# Altium project Chronos.PrjPcb (part 2 of 3)

## Sheet 04 - Camera Interface.SchDoc: Camera Interface (DPHYs)
size A3; Page Number: 4; Page Size: B; Page Count: 12; Board Rev: B; Project Name: CrossLink-NX Evaluation Board; RevCode: 1.0; Doc: 305-PD-19-0819; DsnPath: C:\Users\HAltinkilit\Downloads\Crosslink-NX-Design-Files\CrossLink-NX-Eval-Brd-Schematic-RevB-191122.DSN; SchematicName: SCHEMATIC1; PageName: 04 - Camera Interface; PageSize: B; TopSchematic: True
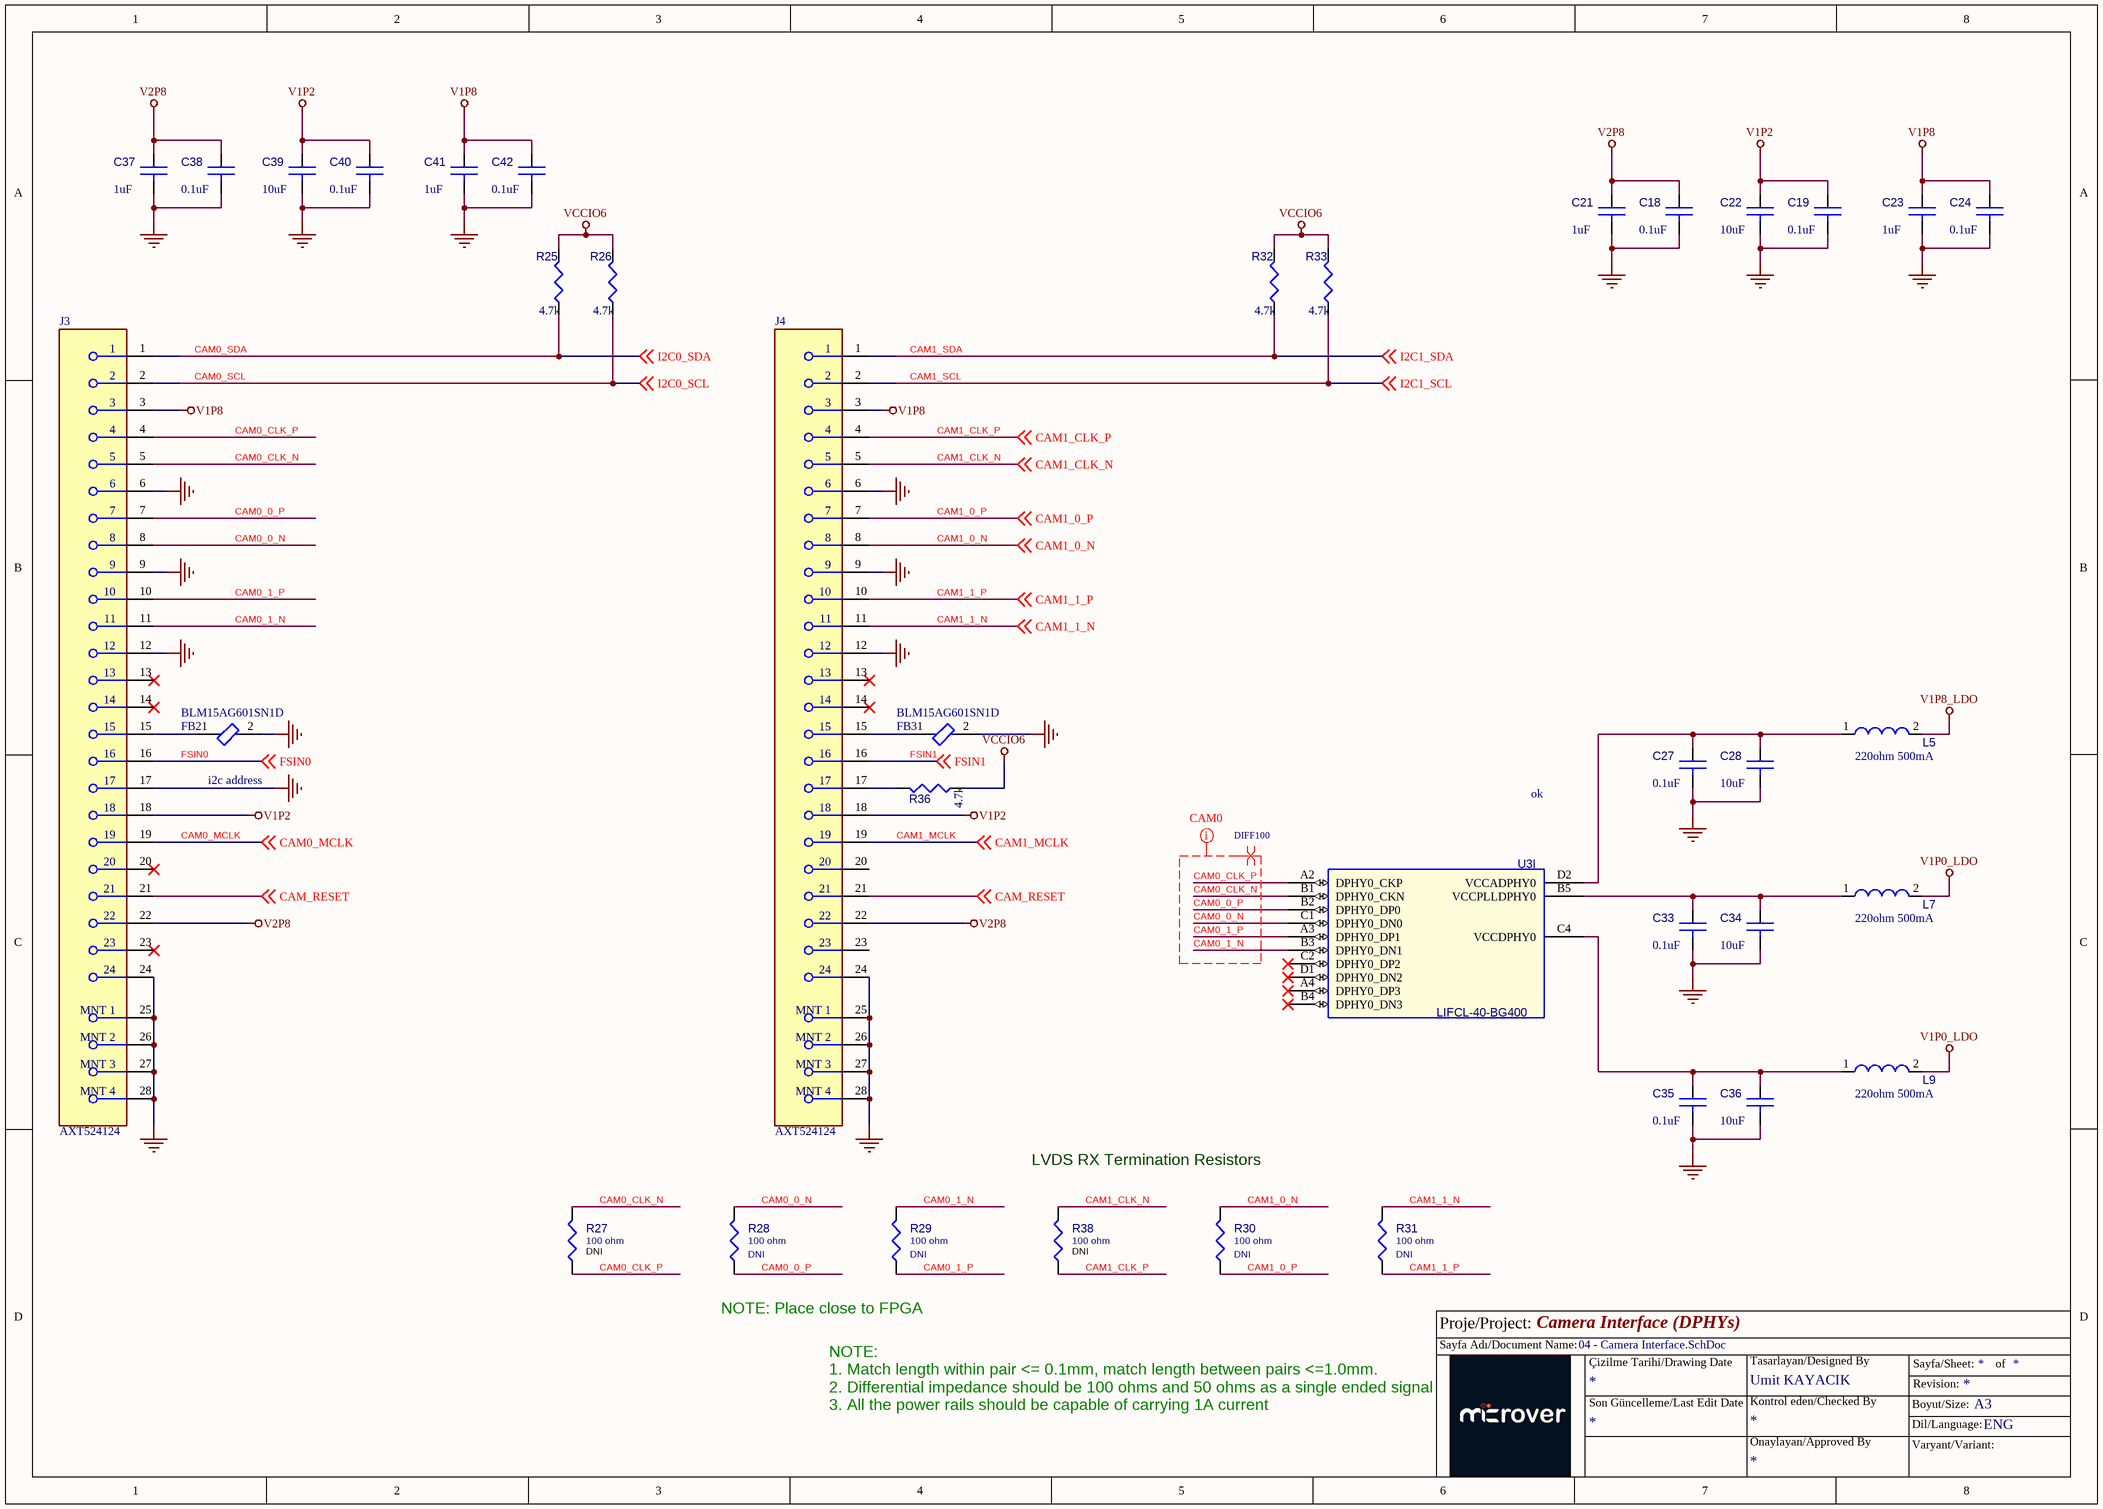
[diagram p3: 04 - Camera Interface.SchDoc]

### Parts
C18  0.1uF  [C0201]
C19  0.1uF  [C0201]
C21  1uF  [C0603]
C22  10uF  [C0603]
C23  1uF  [C0603]
C24  0.1uF  [C0201]
C27  0.1uF  [C0201]
C28  10uF  [C0402]
C33  0.1uF  [C0201]
C34  10uF  [C0402]
C35  0.1uF  [C0201]
C36  10uF  [C0402]
C37  1uF  [C0603]
C38  0.1uF  [C0201]
C39  10uF  [C0603]
C40  0.1uF  [C0201]
C41  1uF  [C0603]
C42  0.1uF  [C0201]
FB2  BLM15AG601SN1D  [FP-BLM15-0_05-MFG]
FB3  BLM15AG601SN1D  [FP-BLM15-0_05-MFG]
J3  AXT524124  [FP-AXT524124-MFG]
J4  AXT524124  [FP-AXT524124-MFG]
L5  220ohm 500mA  [FB0402]
L7  220ohm 500mA  [FB0402]
L9  220ohm 500mA  [FB0402]
R25  4.7k  [R0402]
R26  4.7k  [R0402]
R27  100 ohm  [R0201]
R28  100 ohm  Assy: DNI  [R0201]
R29  100 ohm  Assy: DNI  [R0201]
R30  100 ohm  Assy: DNI  [R0201]
R31  100 ohm  Assy: DNI  [R0201]
R32  4.7k  [R0402]
R33  4.7k  [R0402]
R36  4.7k  [R0402]
R38  100 ohm  [R0201]
U3  LIFCL-40-BG400  [LIFCL-40-BG400]  (part I of 15)

### Nets
GND: C18.2 C19.2 C21.2 C22.2 C23.2 C24.2 C27.2 C28.2 C33.2 C34.2 C35.2 C36.2 C37.2 C38.2 C39.2 C40.2 C41.2 C42.2 FB2.2 FB3.2 J3.6 J3.9 J3.12 J3.17 J3.24 J3.25(MNT_1) J3.26(MNT_2) J3.27(MNT_3) J3.28(MNT_4) J4.6 J4.9 J4.12 J4.24 J4.25(MNT_1) J4.26(MNT_2) J4.27(MNT_3) J4.28(MNT_4)
V1P0_LDO: L7.2 L9.2
V1P2: C19.1 C22.1 C39.1 C40.1 J3.18 J4.18
V1P8: C23.1 C24.1 C41.1 C42.1 J3.3 J4.3
V1P8_LDO: L5.2
V2P8: C18.1 C21.1 C37.1 C38.1 J3.22 J4.22
VCCIO6: R25.1 R26.1 R32.1 R33.1 R36.2
CAM0_0_N: J3.8 R28.2 U3.C1(DPHY0_DN0)
CAM0_0_P: J3.7 R28.1 U3.B2(DPHY0_DP0)
CAM0_1_N: J3.11 R29.2 U3.B3(DPHY0_DN1)
CAM0_1_P: J3.10 R29.1 U3.A3(DPHY0_DP1)
CAM0_CLK_N: J3.5 R27.2 U3.B1(DPHY0_CKN)
CAM0_CLK_P: J3.4 R27.1 U3.A2(DPHY0_CKP)
CAM0_MCLK: J3.19 ; off-sheet CAM0_MCLK
CAM0_SCL: J3.2 R26.2 ; off-sheet I2C0_SCL  [also labelled I2C0_SCL]
CAM0_SDA: J3.1 R25.2 ; off-sheet I2C0_SDA  [also labelled I2C0_SDA]
CAM1_0_N: J4.8 R30.2 ; off-sheet CAM1_0_N
CAM1_0_P: J4.7 R30.1 ; off-sheet CAM1_0_P
CAM1_1_N: J4.11 R31.2 ; off-sheet CAM1_1_N
CAM1_1_P: J4.10 R31.1 ; off-sheet CAM1_1_P
CAM1_CLK_N: J4.5 R38.2 ; off-sheet CAM1_CLK_N
CAM1_CLK_P: J4.4 R38.1 ; off-sheet CAM1_CLK_P
CAM1_MCLK: J4.19 ; off-sheet CAM1_MCLK
CAM1_SCL: J4.2 R33.2 ; off-sheet I2C1_SCL  [also labelled I2C1_SCL]
CAM1_SDA: J4.1 R32.2 ; off-sheet I2C1_SDA  [also labelled I2C1_SDA]
CAM_RESET: J3.21 J4.21 ; off-sheet CAM_RESET
FSIN0: J3.16 ; off-sheet FSIN0
FSIN1: J4.16 ; off-sheet FSIN1
NetC27_1: C27.1 C28.1 L5.1 U3.D2(VCCADPHY0)
NetC33_1: C33.1 C34.1 L7.1 U3.B5(VCCPLLDPHY0)
NetC35_1: C35.1 C36.1 L9.1 U3.C4(VCCDPHY0)
NetFB2_1: FB2.1 J3.15
NetFB3_1: FB3.1 J4.15
NetJ4_17: J4.17 R36.1

Not connected (* = marked no-connect by the designer): J3 13* 14* 20* 23*; J4 13* 14* 20 23; U3 A4(DPHY0_DP3)* B4(DPHY0_DN3)* C2(DPHY0_DP2)* D1(DPHY0_DN2)*

### Layout directives
net class CAM0: CAM0_0_N, CAM0_0_P, CAM0_1_N, CAM0_1_P, CAM0_CLK_N, CAM0_CLK_P
differential pair; differential pair class DIFF100: CAM0_0_N, CAM0_0_P, CAM0_1_N, CAM0_1_P, CAM0_CLK_N, CAM0_CLK_P

### Notes on the sheet
- (near FB2) i2c address
- ok
- LVDS RX Termination Resistors
- (near R27) DNI
- (near R38) DNI
- NOTE: Place close to FPGA
- NOTE:
  1. Match length within pair <= 0.1mm, match length between pairs <=1.0mm.
  2. Differential impedance should be 100 ohms and 50 ohms as a single ended signal
  3. All the power rails should be capable of carrying 1A current
- Proje/Project:
- Sayfa Adı/Document Name:
- Çizilme Tarihi/Drawing Date
- Umit KAYACIK
- Tasarlayan/Designed By
- Sayfa/Sheet:
- Revision:
- of
- Son Güncelleme/Last Edit Date
- Kontrol eden/Checked By
- Onaylayan/Approved By
- Boyut/Size:
- Varyant/Variant:
- Dil/Language:
- A3
- ENG

### Library data of the parts
C18 C38 = 0u1_0402: CAP CER 0.1UF 25V 10% X5R 0201; Manufacturer: Murata; Manufacturer Part Number: GRM033R61E104KE14J; Part Reference: C18; Class: Discrete; Digikey P/N: 399-3521-2-ND; Assy: -; Value: 0.1uF; PCB Footprint: C0201
C19 C40 = 0u1_0402: CAP CER 0.1UF 25V 10% X5R 0201; Manufacturer: Murata; Manufacturer Part Number: GRM033R61E104KE14J; Part Reference: C19; Class: Discrete; Digikey P/N: 399-3521-2-ND; Assy: -; Value: 0.1uF; PCB Footprint: C0201
C21 C37 = 10uF_0603: CAP CECAP CER 10UF 10V X5R 20% 0603; Manufacturer: Taiyo Yuden; Manufacturer Part Number: LMK107BJ106MALTD; Part Reference: C21; Class: Discrete; Digikey P/N: 587-2562-1-ND; Assy: -; Value: 1uF; PCB Footprint: C0603
C22 C39 = 10uF_0603: CAP CECAP CER 10UF 10V X5R 20% 0603; Manufacturer: Taiyo Yuden; Manufacturer Part Number: LMK107BJ106MALTD; Part Reference: C22; Class: Discrete; Digikey P/N: 587-2562-1-ND; Assy: -; Value: 10uF; PCB Footprint: C0603
C23 C41 = 10uF_0603: CAP CECAP CER 10UF 10V X5R 20% 0603; Manufacturer: Taiyo Yuden; Manufacturer Part Number: LMK107BJ106MALTD; Part Reference: C23; Class: Discrete; Digikey P/N: 587-2562-1-ND; Assy: -; Value: 1uF; PCB Footprint: C0603
C24 C42 = 0u1_0402: CAP CER 0.1UF 25V 10% X5R 0201; Manufacturer: Murata; Manufacturer Part Number: GRM033R61E104KE14J; Part Reference: C24; Class: Discrete; Digikey P/N: 399-3521-2-ND; Assy: -; Value: 0.1uF; PCB Footprint: C0201
C27 = 0u1_0402: CAP CER 0.1UF 25V 10% X5R 0201; Manufacturer: Murata; Manufacturer Part Number: GRM033R61E104KE14J; Part Reference: C27; Class: Discrete; Digikey P/N: 399-3521-2-ND; Assy: -; Value: 0.1uF; PCB Footprint: C0201
C28 = 10uF_0603: CAP CER 10UF 10V X5R 0402; Manufacturer: Samsung; Manufacturer Part Number: CL05A106MP8NUB8; Part Reference: C28; Class: Discrete; Digikey P/N: 587-2562-1-ND; Assy: -; Value: 10uF; PCB Footprint: C0402
C33 = 0u1_0402: CAP CER 0.1UF 25V 10% X5R 0201; Manufacturer: Murata; Manufacturer Part Number: GRM033R61E104KE14J; Part Reference: C33; Class: Discrete; Digikey P/N: 399-3521-2-ND; Assy: -; Value: 0.1uF; PCB Footprint: C0201
C34 = 10uF_0603: CAP CER 10UF 10V X5R 0402; Manufacturer: Samsung; Manufacturer Part Number: CL05A106MP8NUB8; Part Reference: C34; Class: Discrete; Digikey P/N: 587-2562-1-ND; Assy: -; Value: 10uF; PCB Footprint: C0402
C35 = 0u1_0402: CAP CER 0.1UF 25V 10% X5R 0201; Manufacturer: Murata; Manufacturer Part Number: GRM033R61E104KE14J; Part Reference: C35; Class: Discrete; Digikey P/N: 399-3521-2-ND; Assy: -; Value: 0.1uF; PCB Footprint: C0201
C36 = 10uF_0603: CAP CER 10UF 10V X5R 0402; Manufacturer: Samsung; Manufacturer Part Number: CL05A106MP8NUB8; Part Reference: C36; Class: Discrete; Digikey P/N: 587-2562-1-ND; Assy: -; Value: 10uF; PCB Footprint: C0402
FB2 FB3 = CMP-0686-00187-4: Chip Ferrite Bead, 0402, 600Ω @ 100MHz, 0.52Ω, 25%, 300mA; DC Resistance-Max: 600mR; Number of Lines: 1; DC Resistance (DCR): 520mR; Shielding: Unshielded; Impedance: 600R; Material: Steel; Frequency: 100MHz; Lead Free: Lead Free; Max DC Current: 300mA; Test Frequency: 100MHz; Depth: 0.55mm; Length: 1mm; Case Code (Imperial): 0402; Packaging: Tape and Reel; Height: 0.5mm; Max Operating Temperature: 125°C; Military Standard: Not; REACH SVHC: No SVHC; Case Code (Metric): 1005; Series: BLM15AG_SN; Core Material: Ferrite; Termination: SMD/SMT; DC Current: 300mA; Package Quantity: 10000; Width: 0.5mm; RoHS Compliant: Yes; Min Operating Temperature: -55°C; Current Rating: 300mA; Case/Package: 0402; Number of Pins: 2; Radiation Hardening: No; Tolerance: 25%; Number of Circuits: 1; Max Current Rating: 300mA
J3 J4 = AXT524124: AXT524124 24 Position 0.4 mm Pitch Dual Row Board to Board Socket Narrow Pitch Connector; NexarPartId: 7879795; Max Current Rating: 5A; Mated Stacking Heights: 1mm; Current Rating: 300mA; Voltage Rating: 60V; Max Voltage Rating (DC): 6.06kV; Number of Positions: 24; Contact Resistance: 90mΩ; Insulation Resistance: 1GΩ; Gender: Receptacle; Pitch: 400µm; Orientation: Straight; Max Operating Temperature: 85°C; Packaging: Cut Tape (CT); Depth: 3mm; Housing Material: Polymer; Ambient Temperature Range High: 85°C; Contact Plating: Gold; Mount: Surface Mount; Termination: Solder; Lead Free: Lead Free; Max Voltage Rating (AC): 60V; Length: 7.3mm; Contact Material: Gold, Nickel; Min Operating Temperature: -55°C; Height: 1.17mm; Number of Contacts: 24; Radiation Hardening: No; Connector Type: Socket; Number of Rows: 2; RoHS: Compliant
L5 = FB0603: FERRITE BEAD 600 OHM 0402 1LN; Manufacturer: Murata; Manufacturer Part Number: BLM15AX601SN1D; Part Reference: L5; Class: Discrete; Digikey P/N: 490-1014-1-ND; Value: 220ohm 500mA; Assy: -; PCB Footprint: FB0402
L7 = FB0603: FERRITE BEAD 600 OHM 0402 1LN; Manufacturer: Murata; Manufacturer Part Number: BLM15AX601SN1D; Part Reference: L7; Class: Discrete; Digikey P/N: 490-1014-1-ND; Value: 220ohm 500mA; Assy: -; PCB Footprint: FB0402
L9 = FB0603: FERRITE BEAD 600 OHM 0402 1LN; Manufacturer: Murata; Manufacturer Part Number: BLM15AX601SN1D; Part Reference: L9; Class: Discrete; Digikey P/N: 490-1014-1-ND; Value: 220ohm 500mA; Assy: -; PCB Footprint: FB0402
R25 R32 = 5k1_0402: RES SMD 2.2K OHM 1% 1/10W 0402; Manufacturer Part Number: ERJ-2RKF2201X; Manufacturer: Panasonic; Part Reference: R25; Class: Discrete; Digikey P/N: 311-5.10KLRTR-ND; Assy: -; Value: 4.7k; BOM NOTE: -; PCB Footprint: R0402
R26 R33 R36 = 5k1_0402: RES SMD 2.2K OHM 1% 1/10W 0402; Manufacturer Part Number: ERJ-2RKF2201X; Manufacturer: Panasonic; Part Reference: R26; Class: Discrete; Digikey P/N: 311-5.10KLRTR-ND; Assy: -; Value: 4.7k; BOM NOTE: -; PCB Footprint: R0402
R27 R38 = RES_100K_1W16_0402_5P: RES SMD 100 OHM 1% 1/20W 0201; Part Reference: R27; Unit Price (USD): 0.02; Total Area(sq-mm): 0.5; Wattage: 1/16W; DIST: FLAT; MAX_TEMP: RTMAX; MFG P/N: RC0201FR-07100RL; MFG: Yageo; TC1: 0; Assy: DNI; Length(mm): 1; Width(mm): 0.5; TC2: 0; Value: 100 ohm; Manufacturer: Yageo; Manufacturer Part Number: RC0201FR-07100RL; PCB Footprint: R0201
R28 = RES_100K_1W16_0402_5P: RES SMD 100 OHM 1% 1/20W 0201; Part Reference: R28; Unit Price (USD): 0.02; Total Area(sq-mm): 0.5; Wattage: 1/16W; DIST: FLAT; MAX_TEMP: RTMAX; MFG P/N: RC0201FR-07100RL; MFG: Yageo; TC1: 0; Length(mm): 1; Width(mm): 0.5; TC2: 0; Value: 100 ohm; Manufacturer: Yageo; Manufacturer Part Number: RC0201FR-07100RL; PCB Footprint: R0201
R29 = RES_100K_1W16_0402_5P: RES SMD 100 OHM 1% 1/20W 0201; Part Reference: R29; Unit Price (USD): 0.02; Total Area(sq-mm): 0.5; Wattage: 1/16W; DIST: FLAT; MAX_TEMP: RTMAX; MFG P/N: RC0201FR-07100RL; MFG: Yageo; TC1: 0; Length(mm): 1; Width(mm): 0.5; TC2: 0; Value: 100 ohm; Manufacturer: Yageo; Manufacturer Part Number: RC0201FR-07100RL; PCB Footprint: R0201
R30 = RES_100K_1W16_0402_5P: RES SMD 100 OHM 1% 1/20W 0201; Part Reference: R30; Unit Price (USD): 0.02; Total Area(sq-mm): 0.5; Wattage: 1/16W; DIST: FLAT; MAX_TEMP: RTMAX; MFG P/N: RC0201FR-07100RL; MFG: Yageo; TC1: 0; Length(mm): 1; Width(mm): 0.5; TC2: 0; Value: 100 ohm; Manufacturer Part Number: RC0201FR-07100RL; Manufacturer: Yageo; PCB Footprint: R0201
R31 = RES_100K_1W16_0402_5P: RES SMD 100 OHM 1% 1/20W 0201; Part Reference: R31; Unit Price (USD): 0.02; Total Area(sq-mm): 0.5; Wattage: 1/16W; DIST: FLAT; MAX_TEMP: RTMAX; MFG P/N: RC0201FR-07100RL; MFG: Yageo; TC1: 0; Length(mm): 1; Width(mm): 0.5; TC2: 0; Value: 100 ohm; Manufacturer Part Number: RC0201FR-07100RL; Manufacturer: Yageo; PCB Footprint: R0201
U3 = LIFCL-40-BG400: Part Reference: U3; SWAP_INFO: (S1+S2+S3+S4+S5+S6+S7+S8+S9+S10+S11+S12+S13+S14+S15); SPLIT_INST: TRUE; Graphic: LIFCL-40-BG400A.Normal; Power Pins Visible: False; Source Library: C:\USERS\SLIU1\DOCUMENTS\PCB_DESIGN\JEDI_EVAL_BOARD\SCHEMATIC\LIFCL40.OLB; Location Y-Coordinate: 0; Implementation Type: <none>; Primitive: DEFAULT; Name: I17266603; Value: LIFCL-40-BG400; Assy: -; Source Package: LIFCL-40-BG400; Source Part: LIFCL-40-BG400A.Normal; Color: Default; Location X-Coordinate: 0; PCB Footprint: LIFCL-40-BG400

## Sheet 05 - Camera Interface 2.SchDoc: Camera Interface (DPHYs)
size A3; Page Number: 5; Page Size: B; Page Count: 12; Board Rev: B; Project Name: CrossLink-NX Evaluation Board; RevCode: 1.0; Doc: 305-PD-19-0819; DsnPath: C:\Users\HAltinkilit\Downloads\Crosslink-NX-Design-Files\CrossLink-NX-Eval-Brd-Schematic-RevB-191122.DSN; SchematicName: SCHEMATIC1; PageName: 04 - Camera Interface; PageSize: B; TopSchematic: True
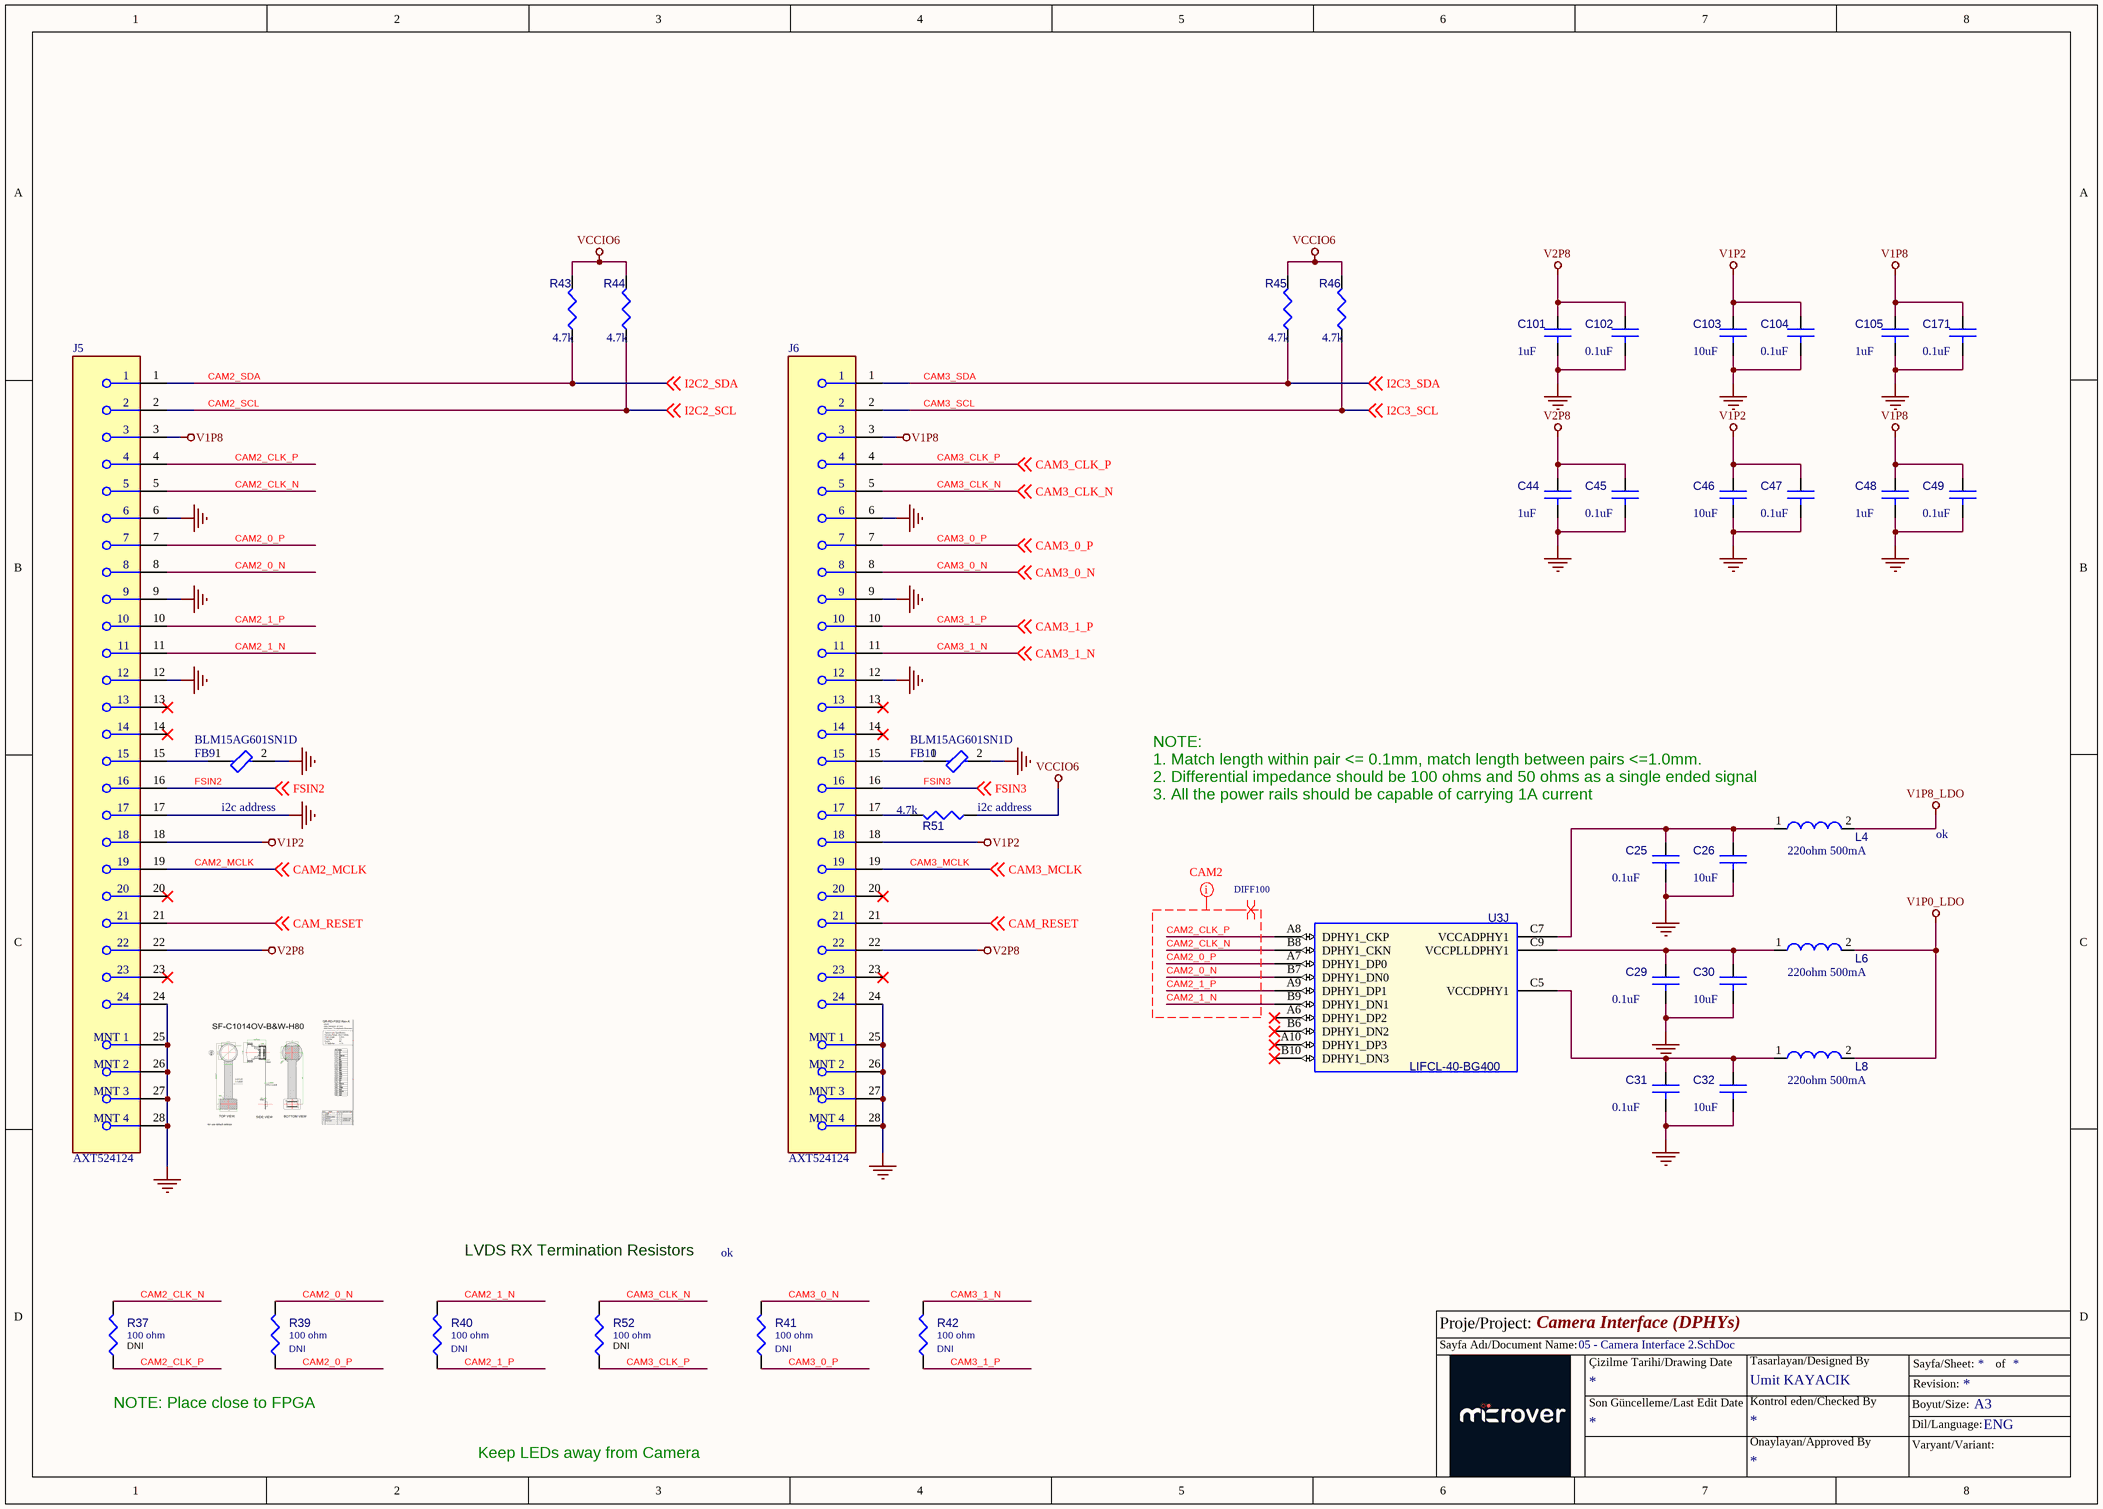
[diagram p4: 05 - Camera Interface 2.SchDoc]

### Parts
C25  0.1uF  [C0201]
C26  10uF  [C0402]
C29  0.1uF  [C0201]
C30  10uF  [C0402]
C31  0.1uF  [C0201]
C32  10uF  [C0402]
C44  1uF  [C0603]
C45  0.1uF  [C0201]
C46  10uF  [C0603]
C47  0.1uF  [C0201]
C48  1uF  [C0603]
C49  0.1uF  [C0201]
C101  1uF  [C0603]
C102  0.1uF  [C0201]
C103  10uF  [C0603]
C104  0.1uF  [C0201]
C105  1uF  [C0603]
C171  0.1uF  [C0201]
FB9  BLM15AG601SN1D  [FP-BLM15-0_05-MFG]
FB10  BLM15AG601SN1D  [FP-BLM15-0_05-MFG]
J5  AXT524124  [FP-AXT524124-MFG]
J6  AXT524124  [FP-AXT524124-MFG]
L4  220ohm 500mA  [FB0402]
L6  220ohm 500mA  [FB0402]
L8  220ohm 500mA  [FB0402]
R37  100 ohm  [R0201]
R39  100 ohm  Assy: DNI  [R0201]
R40  100 ohm  Assy: DNI  [R0201]
R41  100 ohm  Assy: DNI  [R0201]
R42  100 ohm  Assy: DNI  [R0201]
R43  4.7k  [R0402]
R44  4.7k  [R0402]
R45  4.7k  [R0402]
R46  4.7k  [R0402]
R51  4.7k  [R0402]
R52  100 ohm  [R0201]
U3  LIFCL-40-BG400  [LIFCL-40-BG400]  (part J of 15)

### Nets
GND: C25.2 C26.2 C29.2 C30.2 C31.2 C32.2 C44.2 C45.2 C46.2 C47.2 C48.2 C49.2 C101.2 C102.2 C103.2 C104.2 C105.2 C171.2 FB9.2 FB10.2 J5.6 J5.9 J5.12 J5.17 J5.24 J5.25(MNT_1) J5.26(MNT_2) J5.27(MNT_3) J5.28(MNT_4) J6.6 J6.9 J6.12 J6.24 J6.25(MNT_1) J6.26(MNT_2) J6.27(MNT_3) J6.28(MNT_4)
V1P0_LDO: L6.2 L8.2
V1P2: C46.1 C47.1 C103.1 C104.1 J5.18 J6.18
V1P8: C48.1 C49.1 C105.1 C171.1 J5.3 J6.3
V1P8_LDO: L4.2
V2P8: C44.1 C45.1 C101.1 C102.1 J5.22 J6.22
VCCIO6: R43.1 R44.1 R45.1 R46.1 R51.2
CAM2_0_N: J5.8 R39.2 U3.B7(DPHY1_DN0)
CAM2_0_P: J5.7 R39.1 U3.A7(DPHY1_DP0)
CAM2_1_N: J5.11 R40.2 U3.B9(DPHY1_DN1)
CAM2_1_P: J5.10 R40.1 U3.A9(DPHY1_DP1)
CAM2_CLK_N: J5.5 R37.2 U3.B8(DPHY1_CKN)
CAM2_CLK_P: J5.4 R37.1 U3.A8(DPHY1_CKP)
CAM2_MCLK: J5.19 ; off-sheet CAM2_MCLK
CAM2_SCL: J5.2 R44.2 ; off-sheet I2C2_SCL  [also labelled I2C2_SCL]
CAM2_SDA: J5.1 R43.2 ; off-sheet I2C2_SDA  [also labelled I2C2_SDA]
CAM3_0_N: J6.8 R41.2 ; off-sheet CAM3_0_N
CAM3_0_P: J6.7 R41.1 ; off-sheet CAM3_0_P
CAM3_1_N: J6.11 R42.2 ; off-sheet CAM3_1_N
CAM3_1_P: J6.10 R42.1 ; off-sheet CAM3_1_P
CAM3_CLK_N: J6.5 R52.2 ; off-sheet CAM3_CLK_N
CAM3_CLK_P: J6.4 R52.1 ; off-sheet CAM3_CLK_P
CAM3_MCLK: J6.19 ; off-sheet CAM3_MCLK
CAM3_SCL: J6.2 R46.2 ; off-sheet I2C3_SCL  [also labelled I2C3_SCL]
CAM3_SDA: J6.1 R45.2 ; off-sheet I2C3_SDA  [also labelled I2C3_SDA]
CAM_RESET: J5.21 J6.21 ; off-sheet CAM_RESET
FSIN2: J5.16 ; off-sheet FSIN2
FSIN3: J6.16 ; off-sheet FSIN3
NetC25_1: C25.1 C26.1 L4.1 U3.C7(VCCADPHY1)
NetC29_1: C29.1 C30.1 L6.1 U3.C9(VCCPLLDPHY1)
NetC31_1: C31.1 C32.1 L8.1 U3.C5(VCCDPHY1)
NetFB9_1: FB9.1 J5.15
NetFB10_1: FB10.1 J6.15
NetJ6_17: J6.17 R51.1

Not connected (* = marked no-connect by the designer): J5 13* 14* 20* 23*; J6 13* 14* 20* 23*; U3 A6(DPHY1_DP2)* A10(DPHY1_DP3)* B6(DPHY1_DN2)* B10(DPHY1_DN3)*

### Layout directives
net class CAM2: CAM2_0_N, CAM2_0_P, CAM2_1_N, CAM2_1_P, CAM2_CLK_N, CAM2_CLK_P
differential pair; differential pair class DIFF100: CAM2_0_N, CAM2_0_P, CAM2_1_N, CAM2_1_P, CAM2_CLK_N, CAM2_CLK_P

### Notes on the sheet
- (near FB9) i2c address
- (near R51) i2c address
- (near L4) NOTE:
  1. Match length within pair <= 0.1mm, match length between pairs <=1.0mm.
  2. Differential impedance should be 100 ohms and 50 ohms as a single ended signal
  3. All the power rails should be capable of carrying 1A current
- ok
- LVDS RX Termination Resistors
- (near R37) DNI
- (near R52) DNI
- NOTE: Place close to FPGA
- Keep LEDs away from Camera
- Proje/Project:
- Sayfa Adı/Document Name:
- Çizilme Tarihi/Drawing Date
- Umit KAYACIK
- Tasarlayan/Designed By
- Sayfa/Sheet:
- Revision:
- of
- Son Güncelleme/Last Edit Date
- Kontrol eden/Checked By
- Onaylayan/Approved By
- Boyut/Size:
- Varyant/Variant:
- Dil/Language:
- A3
- ENG

### Library data of the parts
C25 = 0u1_0402: CAP CER 0.1UF 25V 10% X5R 0201; Manufacturer: Murata; Manufacturer Part Number: GRM033R61E104KE14J; Part Reference: C25; Class: Discrete; Digikey P/N: 399-3521-2-ND; Assy: -; Value: 0.1uF; PCB Footprint: C0201
C26 = 10uF_0603: CAP CER 10UF 10V X5R 0402; Manufacturer: Samsung; Manufacturer Part Number: CL05A106MP8NUB8; Part Reference: C26; Class: Discrete; Digikey P/N: 587-2562-1-ND; Assy: -; Value: 10uF; PCB Footprint: C0402
C29 = 0u1_0402: CAP CER 0.1UF 25V 10% X5R 0201; Manufacturer: Murata; Manufacturer Part Number: GRM033R61E104KE14J; Part Reference: C29; Class: Discrete; Digikey P/N: 399-3521-2-ND; Assy: -; Value: 0.1uF; PCB Footprint: C0201
C30 = 10uF_0603: CAP CER 10UF 10V X5R 0402; Manufacturer: Samsung; Manufacturer Part Number: CL05A106MP8NUB8; Part Reference: C30; Class: Discrete; Digikey P/N: 587-2562-1-ND; Assy: -; Value: 10uF; PCB Footprint: C0402
C31 = 0u1_0402: CAP CER 0.1UF 25V 10% X5R 0201; Manufacturer: Murata; Manufacturer Part Number: GRM033R61E104KE14J; Part Reference: C31; Class: Discrete; Digikey P/N: 399-3521-2-ND; Assy: -; Value: 0.1uF; PCB Footprint: C0201
C32 = 10uF_0603: CAP CER 10UF 10V X5R 0402; Manufacturer: Samsung; Manufacturer Part Number: CL05A106MP8NUB8; Part Reference: C32; Class: Discrete; Digikey P/N: 587-2562-1-ND; Assy: -; Value: 10uF; PCB Footprint: C0402
C44 C101 = 10uF_0603: as C21 on sheet 04 - Camera Interface; Digikey P/N: 587-2562-1-ND; Assy: -; Value: 1uF; PCB Footprint: C0603
C45 C102 = 0u1_0402: as C18 on sheet 04 - Camera Interface; Digikey P/N: 399-3521-2-ND; Assy: -; Value: 0.1uF; PCB Footprint: C0201
C46 C103 = 10uF_0603: as C22 on sheet 04 - Camera Interface; Digikey P/N: 587-2562-1-ND; Assy: -; Value: 10uF; PCB Footprint: C0603
C47 C104 = 0u1_0402: as C19 on sheet 04 - Camera Interface; Digikey P/N: 399-3521-2-ND; Assy: -; Value: 0.1uF; PCB Footprint: C0201
C48 C105 = 10uF_0603: as C23 on sheet 04 - Camera Interface; Digikey P/N: 587-2562-1-ND; Assy: -; Value: 1uF; PCB Footprint: C0603
C49 C171 = 0u1_0402: as C24 on sheet 04 - Camera Interface; Digikey P/N: 399-3521-2-ND; Assy: -; Value: 0.1uF; PCB Footprint: C0201
FB9 FB10 = CMP-0686-00187-4: as FB2 on sheet 04 - Camera Interface; Frequency: 100MHz; Lead Free: Lead Free; Max DC Current: 300mA; Test Frequency: 100MHz; Depth: 0.55mm; Length: 1mm; Case Code (Imperial): 0402; Packaging: Tape and Reel; Height: 0.5mm; Max Operating Temperature: 125°C; Military Standard: Not; REACH SVHC: No SVHC; Case Code (Metric): 1005; Series: BLM15AG_SN; Core Material: Ferrite; Termination: SMD/SMT; DC Current: 300mA; Package Quantity: 10000; Width: 0.5mm; RoHS Compliant: Yes; Min Operating Temperature: -55°C; Current Rating: 300mA; Case/Package: 0402; Number of Pins: 2; Radiation Hardening: No; Tolerance: 25%; Number of Circuits: 1; Max Current Rating: 300mA
J5 J6 = AXT524124: as J3 on sheet 04 - Camera Interface; Orientation: Straight; Max Operating Temperature: 85°C; Packaging: Cut Tape (CT); Depth: 3mm; Housing Material: Polymer; Ambient Temperature Range High: 85°C; Contact Plating: Gold; Mount: Surface Mount; Termination: Solder; Lead Free: Lead Free; Max Voltage Rating (AC): 60V; Length: 7.3mm; Contact Material: Gold, Nickel; Min Operating Temperature: -55°C; Height: 1.17mm; Number of Contacts: 24; Radiation Hardening: No; Connector Type: Socket; Number of Rows: 2; RoHS: Compliant
L4 = FB0603: FERRITE BEAD 600 OHM 0402 1LN; Manufacturer: Murata; Manufacturer Part Number: BLM15AX601SN1D; Part Reference: L4; Class: Discrete; Digikey P/N: 490-1014-1-ND; Value: 220ohm 500mA; Assy: -; PCB Footprint: FB0402
L6 = FB0603: FERRITE BEAD 600 OHM 0402 1LN; Manufacturer: Murata; Manufacturer Part Number: BLM15AX601SN1D; Part Reference: L6; Class: Discrete; Digikey P/N: 490-1014-1-ND; Value: 220ohm 500mA; Assy: -; PCB Footprint: FB0402
L8 = FB0603: FERRITE BEAD 600 OHM 0402 1LN; Manufacturer: Murata; Manufacturer Part Number: BLM15AX601SN1D; Part Reference: L8; Class: Discrete; Digikey P/N: 490-1014-1-ND; Value: 220ohm 500mA; Assy: -; PCB Footprint: FB0402
R37 R52 = RES_100K_1W16_0402_5P: as R27 on sheet 04 - Camera Interface; Length(mm): 1; Width(mm): 0.5; TC2: 0; Value: 100 ohm; Manufacturer: Yageo; Manufacturer Part Number: RC0201FR-07100RL; PCB Footprint: R0201
R39 = RES_100K_1W16_0402_5P: as R28 on sheet 04 - Camera Interface; Length(mm): 1; Width(mm): 0.5; TC2: 0; Value: 100 ohm; Manufacturer: Yageo; Manufacturer Part Number: RC0201FR-07100RL; PCB Footprint: R0201
R40 = RES_100K_1W16_0402_5P: as R29 on sheet 04 - Camera Interface; Length(mm): 1; Width(mm): 0.5; TC2: 0; Value: 100 ohm; Manufacturer: Yageo; Manufacturer Part Number: RC0201FR-07100RL; PCB Footprint: R0201
R41 = RES_100K_1W16_0402_5P: as R30 on sheet 04 - Camera Interface; Length(mm): 1; Width(mm): 0.5; TC2: 0; Value: 100 ohm; Manufacturer Part Number: RC0201FR-07100RL; Manufacturer: Yageo; PCB Footprint: R0201
R42 = RES_100K_1W16_0402_5P: as R31 on sheet 04 - Camera Interface; Length(mm): 1; Width(mm): 0.5; TC2: 0; Value: 100 ohm; Manufacturer Part Number: RC0201FR-07100RL; Manufacturer: Yageo; PCB Footprint: R0201
R43 R45 = 5k1_0402: as R25 on sheet 04 - Camera Interface; Digikey P/N: 311-5.10KLRTR-ND; Assy: -; Value: 4.7k; BOM NOTE: -; PCB Footprint: R0402
R44 R46 R51 = 5k1_0402: as R26 on sheet 04 - Camera Interface; Digikey P/N: 311-5.10KLRTR-ND; Assy: -; Value: 4.7k; BOM NOTE: -; PCB Footprint: R0402
U3 = LIFCL-40-BG400: as U3 on sheet 04 - Camera Interface; Value: LIFCL-40-BG400; Assy: -; Source Package: LIFCL-40-BG400; Source Part: LIFCL-40-BG400A.Normal; Color: Default; Location X-Coordinate: 0; PCB Footprint: LIFCL-40-BG400

## Sheet 06 - Soft_DPHY.SchDoc: Soft DPHY
size A3; Date:: 0; Page Number: 6; Page Size: B; Page Count: 12; Board Rev: B; Project Name: CrossLink-NX Evaluation Board; RevCode: 1.0; Doc: 305-PD-19-0819; DsnPath: C:\Users\HAltinkilit\Downloads\Crosslink-NX-Design-Files\CrossLink-NX-Eval-Brd-Schematic-RevB-191122.DSN; SchematicName: SCHEMATIC1; PageName: 10 - FMC-LPC; PageSize: B; TopSchematic: True
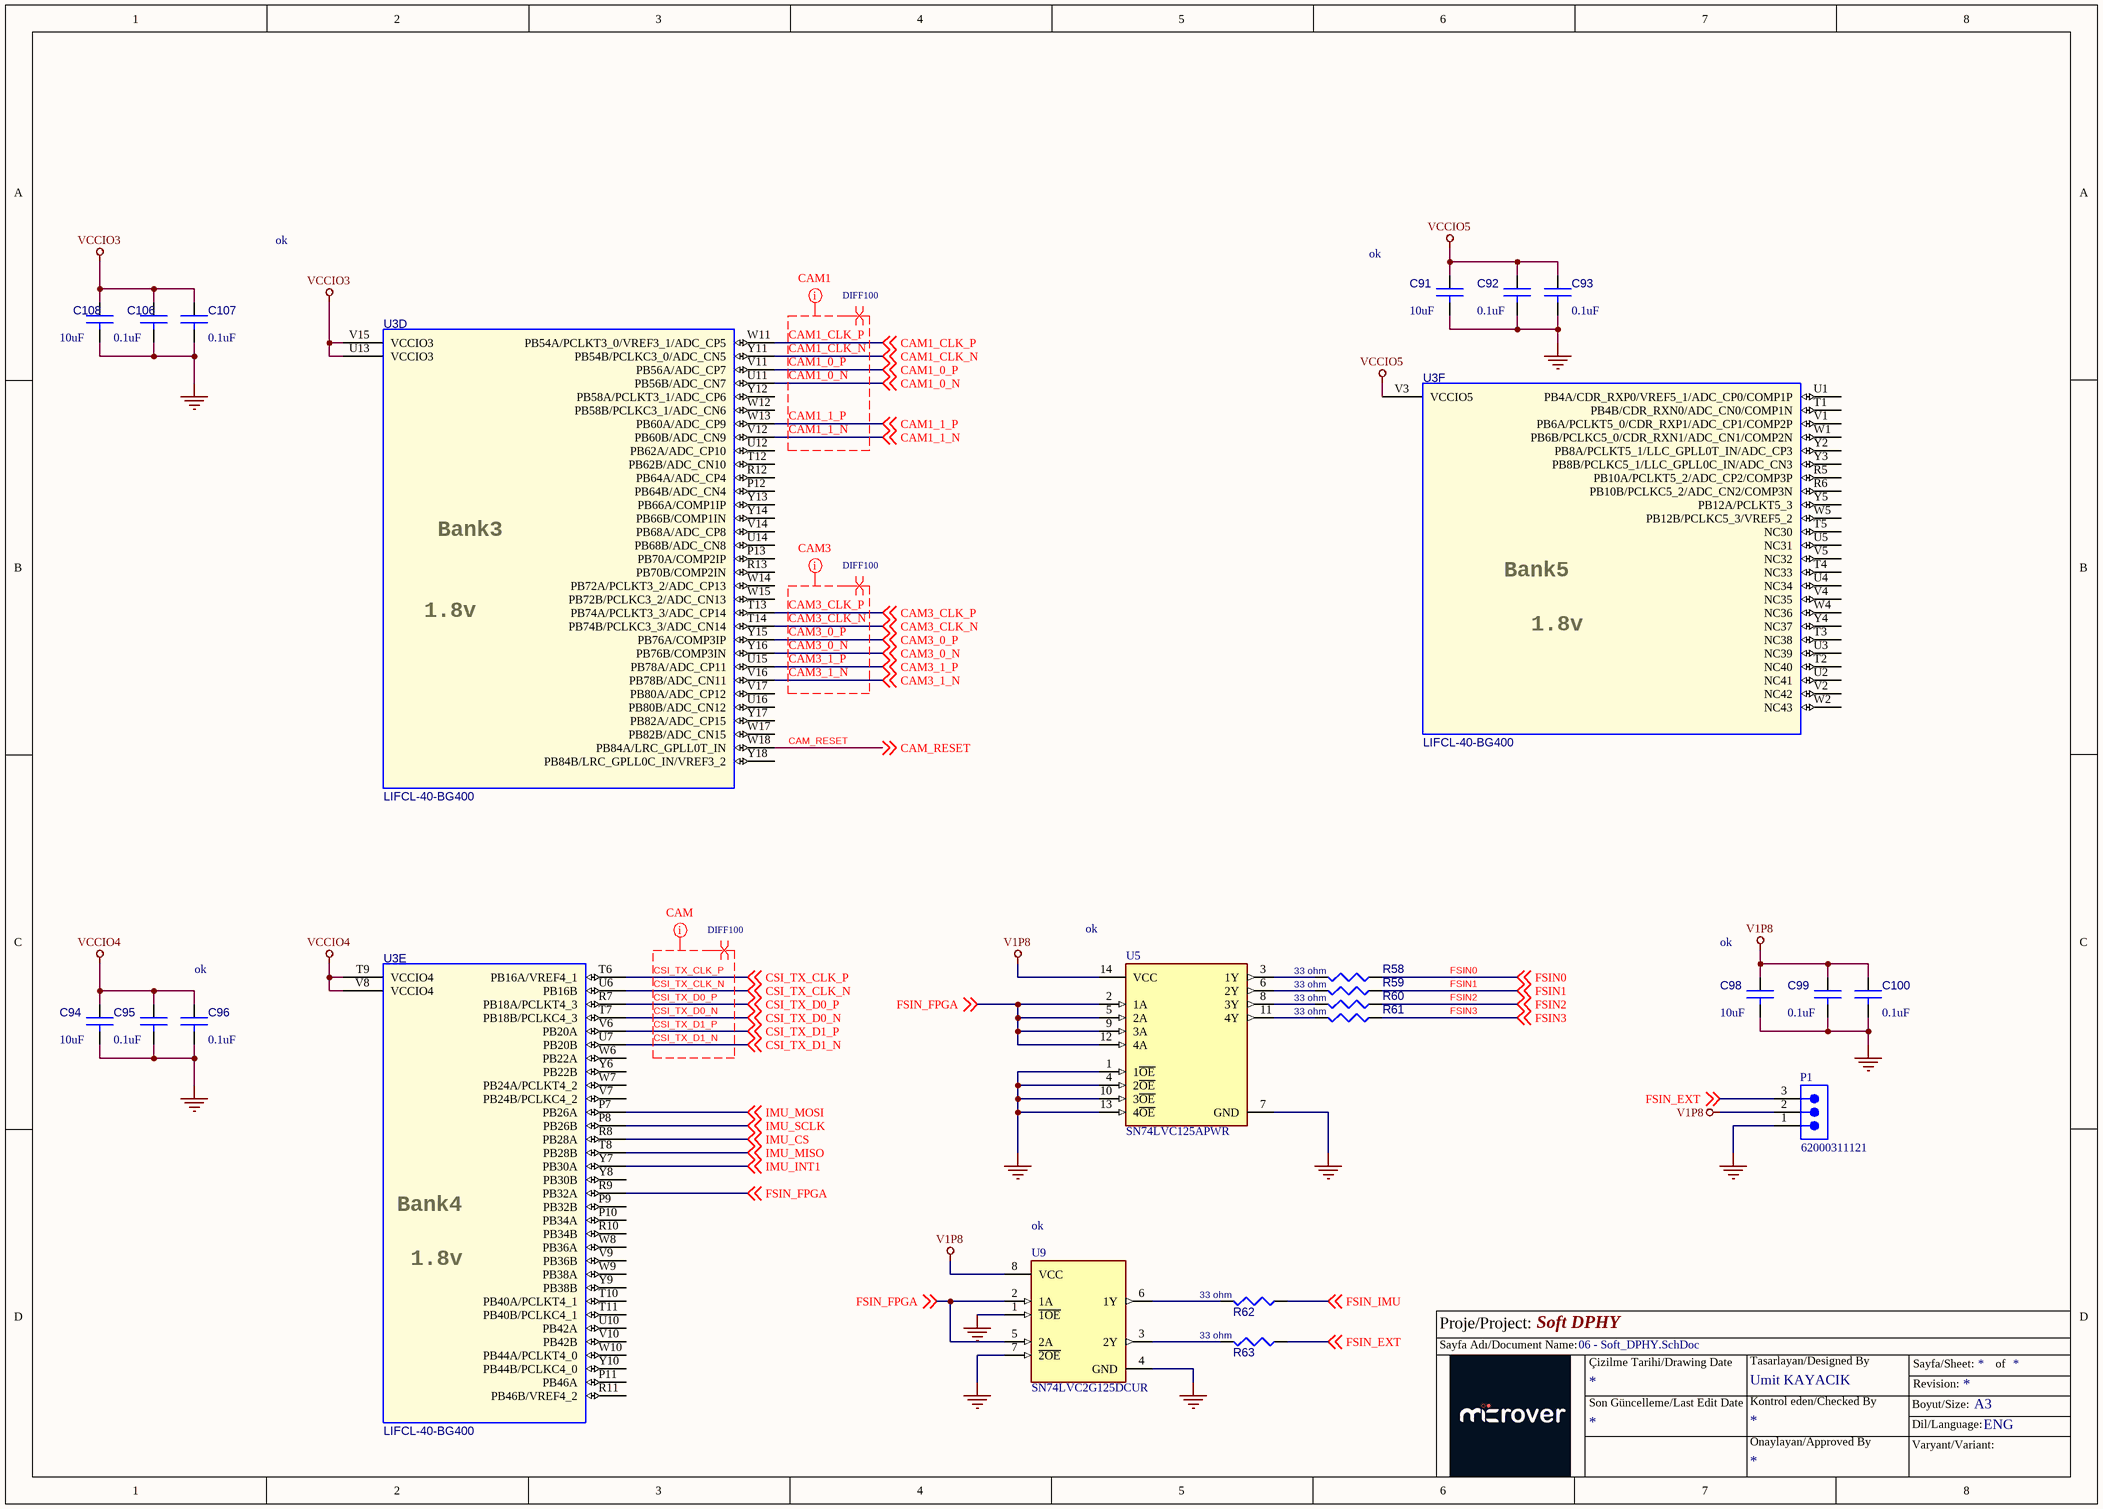
[diagram p5: 06 - Soft_DPHY.SchDoc]

### Parts
C91  10uF  [C0603]
C92  0.1uF  [C0201]
C93  0.1uF  [C0201]
C94  10uF  [C0603]
C95  0.1uF  [C0201]
C96  0.1uF  [C0201]
C98  10uF  [C0603]
C99  0.1uF  [C0201]
C100  0.1uF  [C0201]
C106  0.1uF  [C0201]
C107  0.1uF  [C0201]
C108  10uF  [C0603]
P1  62000311121  [62000311121]
R58  33 ohm  [R0402]
R59  33 ohm  [R0402]
R60  33 ohm  [R0402]
R61  33 ohm  [R0402]
R62  33 ohm  [RLP-100]
R63  33 ohm  [R0402]
U3  LIFCL-40-BG400  [LIFCL-40-BG400]  (parts D,E,F of 15)
U5  SN74LVC125APWR  [FP-PW0014A-IPC_B]
U9  SN74LVC2G125DCUR  [FP-DCU0008A-MFG]

### Nets
GND: C91.2 C92.2 C93.2 C94.2 C95.2 C96.2 C98.2 C99.2 C100.2 C106.2 C107.2 C108.2 P1.1 U5.1(1~{OE}) U5.4(2~{OE}) U5.7(GND) U5.10(3~{OE}) U5.13(4~{OE}) U9.1(~{1OE}) U9.4(GND) U9.7(~{2OE})
V1P8: C98.1 C99.1 C100.1 P1.2 U5.14(VCC) U9.8(VCC)
VCCIO3: C106.1 C107.1 C108.1 U3.U13(VCCIO3) U3.V15(VCCIO3)
VCCIO4: C94.1 C95.1 C96.1 U3.T9(VCCIO4) U3.V8(VCCIO4)
VCCIO5: C91.1 C92.1 C93.1 U3.V3(VCCIO5)
CAM1_0_N: U3.U11(PB56B/ADC_CN7) ; off-sheet CAM1_0_N
CAM1_0_P: U3.V11(PB56A/ADC_CP7) ; off-sheet CAM1_0_P
CAM1_1_N: U3.V12(PB60B/ADC_CN9) ; off-sheet CAM1_1_N
CAM1_1_P: U3.W13(PB60A/ADC_CP9) ; off-sheet CAM1_1_P
CAM1_CLK_N: U3.Y11(PB54B/PCLKC3_0/ADC_CN5) ; off-sheet CAM1_CLK_N
CAM1_CLK_P: U3.W11(PB54A/PCLKT3_0/VREF3_1/ADC_CP5) ; off-sheet CAM1_CLK_P
CAM3_0_N: U3.Y16(PB76B/COMP3IN) ; off-sheet CAM3_0_N
CAM3_0_P: U3.Y15(PB76A/COMP3IP) ; off-sheet CAM3_0_P
CAM3_1_N: U3.V16(PB78B/ADC_CN11) ; off-sheet CAM3_1_N
CAM3_1_P: U3.U15(PB78A/ADC_CP11) ; off-sheet CAM3_1_P
CAM3_CLK_N: U3.T14(PB74B/PCLKC3_3/ADC_CN14) ; off-sheet CAM3_CLK_N
CAM3_CLK_P: U3.T13(PB74A/PCLKT3_3/ADC_CP14) ; off-sheet CAM3_CLK_P
CAM_RESET: U3.W18(PB84A/LRC_GPLL0T_IN) ; off-sheet CAM_RESET
CSI_TX_CLK_N: U3.U6(PB16B) ; off-sheet CSI_TX_CLK_N
CSI_TX_CLK_P: U3.T6(PB16A/VREF4_1) ; off-sheet CSI_TX_CLK_P
CSI_TX_D0_N: U3.T7(PB18B/PCLKC4_3) ; off-sheet CSI_TX_D0_N
CSI_TX_D0_P: U3.R7(PB18A/PCLKT4_3) ; off-sheet CSI_TX_D0_P
CSI_TX_D1_N: U3.U7(PB20B) ; off-sheet CSI_TX_D1_N
CSI_TX_D1_P: U3.V6(PB20A) ; off-sheet CSI_TX_D1_P
FSIN0: R58.2 ; off-sheet FSIN0
FSIN1: R59.2 ; off-sheet FSIN1
FSIN2: R60.2 ; off-sheet FSIN2
FSIN3: R61.2 ; off-sheet FSIN3
FSIN_EXT: P1.3 R63.2 ; off-sheet FSIN_EXT
FSIN_FPGA: U3.R9(PB32A) U5.2(1A) U5.5(2A) U5.9(3A) U5.12(4A) U9.2(1A) U9.5(2A) ; off-sheet FSIN_FPGA
FSIN_IMU: R62.2 ; off-sheet FSIN_IMU
IMU_CS: U3.R8(PB28A) ; off-sheet IMU_CS
IMU_INT1: U3.Y7(PB30A) ; off-sheet IMU_INT1
IMU_MISO: U3.T8(PB28B) ; off-sheet IMU_MISO
IMU_MOSI: U3.P7(PB26A) ; off-sheet IMU_MOSI
IMU_SCLK: U3.P8(PB26B) ; off-sheet IMU_SCLK
NetR58_1: R58.1 U5.3(1Y)
NetR59_1: R59.1 U5.6(2Y)
NetR60_1: R60.1 U5.8(3Y)
NetR61_1: R61.1 U5.11(4Y)
NetR62_1: R62.1 U9.6(1Y)
NetR63_1: R63.1 U9.3(2Y)

Not connected (* = marked no-connect by the designer): U3 P9(PB32B) P10(PB34A) P11(PB46A) P12(PB64B/ADC_CN4) P13(PB70A/COMP2IP) R5(PB10A/PCLKT5_2/ADC_CP2/COMP3P) R6(PB10B/PCLKC5_2/ADC_CN2/COMP3N) R10(PB34B) R11(PB46B/VREF4_2) R12(PB64A/ADC_CP4) R13(PB70B/COMP2IN) T1(PB4B/CDR_RXN0/ADC_CN0/COMP1N) T2(NC40) T3(NC38) T4(NC33) T5(NC30) T10(PB40A/PCLKT4_1) T11(PB40B/PCLKC4_1) T12(PB62B/ADC_CN10) U1(PB4A/CDR_RXP0/VREF5_1/ADC_CP0/COMP1P) U2(NC41) U3(NC39) U4(NC34) U5(NC31) U10(PB42A) U12(PB62A/ADC_CP10) U14(PB68B/ADC_CN8) U16(PB80B/ADC_CN12) V1(PB6A/PCLKT5_0/CDR_RXP1/ADC_CP1/COMP2P) V2(NC42) V4(NC35) V5(NC32) V7(PB24B/PCLKC4_2) V9(PB36B) V10(PB42B) V14(PB68A/ADC_CP8) V17(PB80A/ADC_CP12) W1(PB6B/PCLKC5_0/CDR_RXN1/ADC_CN1/COMP2N) W2(NC43) W4(NC36) W5(PB12B/PCLKC5_3/VREF5_2) W6(PB22A) W7(PB24A/PCLKT4_2) W8(PB36A) W9(PB38A) W10(PB44A/PCLKT4_0) W12(PB58B/PCLKC3_1/ADC_CN6) W14(PB72A/PCLKT3_2/ADC_CP13) W15(PB72B/PCLKC3_2/ADC_CN13) W17(PB82B/ADC_CN15) Y2(PB8A/PCLKT5_1/LLC_GPLL0T_IN/ADC_CP3) Y3(PB8B/PCLKC5_1/LLC_GPLL0C_IN/ADC_CN3) Y4(NC37) Y5(PB12A/PCLKT5_3) Y6(PB22B) Y8(PB30B) Y9(PB38B) Y10(PB44B/PCLKC4_0) Y12(PB58A/PCLKT3_1/ADC_CP6) Y13(PB66A/COMP1IP) Y14(PB66B/COMP1IN) Y17(PB82A/ADC_CP15) Y18(PB84B/LRC_GPLL0C_IN/VREF3_2)

### Layout directives
net class CAM3: CAM3_0_N, CAM3_0_P, CAM3_1_N, CAM3_1_P, CAM3_CLK_N, CAM3_CLK_P
differential pair; differential pair class DIFF100: CAM1_0_N, CAM1_0_P, CAM1_1_N, CAM1_1_P, CAM1_CLK_N, CAM1_CLK_P, CAM3_0_N, CAM3_0_P, CAM3_1_N, CAM3_1_P, CAM3_CLK_N, CAM3_CLK_P, CSI_TX_CLK_N, CSI_TX_CLK_P, CSI_TX_D0_N, CSI_TX_D0_P, CSI_TX_D1_N, CSI_TX_D1_P
net class CAM1: CAM1_0_N, CAM1_0_P, CAM1_1_N, CAM1_1_P, CAM1_CLK_N, CAM1_CLK_P
net class CAM: CSI_TX_CLK_N, CSI_TX_CLK_P, CSI_TX_D0_N, CSI_TX_D0_P, CSI_TX_D1_N, CSI_TX_D1_P

### Notes on the sheet
- ok
- (near U3) Bank3
- (near U3) Bank5
- (near U3) 1.8v
- (near U5) ok
- (near C98) ok
- (near U3) Bank4
- (near U9) ok
- Proje/Project:
- Sayfa Adı/Document Name:
- Çizilme Tarihi/Drawing Date
- Umit KAYACIK
- Tasarlayan/Designed By
- Sayfa/Sheet:
- Revision:
- of
- Son Güncelleme/Last Edit Date
- Kontrol eden/Checked By
- Onaylayan/Approved By
- Boyut/Size:
- Varyant/Variant:
- Dil/Language:
- A3
- ENG

### Library data of the parts
C91 C98 = 10uF_0603: CAP CECAP CER 10UF 10V X5R 20% 0603; Manufacturer: Taiyo Yuden; Manufacturer Part Number: LMK107BJ106MALTD; Part Reference: C91; Class: Discrete; Digikey P/N: 587-2562-1-ND; Assy: -; Value: 10uF; PCB Footprint: C0603
C92 C99 = 0u1_0402: CAP CER 0.1UF 25V 10% X5R 0201; Manufacturer: Murata; Manufacturer Part Number: GRM033R61E104KE14J; Part Reference: C92; Class: Discrete; Digikey P/N: 399-3521-2-ND; Assy: -; Value: 0.1uF; PCB Footprint: C0201
C93 C100 = 0u1_0402: CAP CER 0.1UF 25V 10% X5R 0201; Manufacturer: Murata; Manufacturer Part Number: GRM033R61E104KE14J; Part Reference: C93; Class: Discrete; Digikey P/N: 399-3521-2-ND; Assy: -; Value: 0.1uF; PCB Footprint: C0201
C94 = 10uF_0603: CAP CECAP CER 10UF 10V X5R 20% 0603; Manufacturer: Taiyo Yuden; Manufacturer Part Number: LMK107BJ106MALTD; Part Reference: C94; Class: Discrete; Digikey P/N: 587-2562-1-ND; Assy: -; Value: 10uF; PCB Footprint: C0603
C95 = 0u1_0402: CAP CER 0.1UF 25V 10% X5R 0201; Manufacturer: Murata; Manufacturer Part Number: GRM033R61E104KE14J; Part Reference: C95; Class: Discrete; Digikey P/N: 399-3521-2-ND; Assy: -; Value: 0.1uF; PCB Footprint: C0201
C96 = 0u1_0402: CAP CER 0.1UF 25V 10% X5R 0201; Manufacturer: Murata; Manufacturer Part Number: GRM033R61E104KE14J; Part Reference: C96; Class: Discrete; Digikey P/N: 399-3521-2-ND; Assy: -; Value: 0.1uF; PCB Footprint: C0201
C106 = 0u1_0402: CAP CER 0.1UF 25V 10% X5R 0201; Manufacturer: Murata; Manufacturer Part Number: GRM033R61E104KE14J; Part Reference: C106; Class: Discrete; Digikey P/N: 399-3521-2-ND; Assy: -; Value: 0.1uF; PCB Footprint: C0201
C107 = 0u1_0402: CAP CER 0.1UF 25V 10% X5R 0201; Manufacturer: Murata; Manufacturer Part Number: GRM033R61E104KE14J; Part Reference: C107; Class: Discrete; Digikey P/N: 399-3521-2-ND; Assy: -; Value: 0.1uF; PCB Footprint: C0201
C108 = 10uF_0603: CAP CECAP CER 10UF 10V X5R 20% 0603; Manufacturer: Taiyo Yuden; Manufacturer Part Number: LMK107BJ106MALTD; Part Reference: C108; Class: Discrete; Digikey P/N: 587-2562-1-ND; Assy: -; Value: 10uF; PCB Footprint: C0603
P1 = CMP-1502-00957-5: THT Vertical Pin Header WR-PHD, Pitch 2.00 mm, Single Row, 3 pins; Voltage Rating: 200V; Current Rating: 2A; Gender: Male; Contact Resistance: 20mΩ; Number of Contacts: 3; Min Operating Temperature: -40°C; Max Operating Temperature: 105°C; Height: 6.35mm; Operating Supply Voltage: 200V; Number of Rows: 1; RoHS: Compliant; Number of Pins: 3; Contact Material: Gold; Lead Pitch: 2mm; Orientation: Vertical
R58-R63 = RES_100K_1W16_0402_5P: RES SMD 33 OHM 1% 1/20W 0201; Part Reference: R27; Unit Price (USD): 0.02; Total Area(sq-mm): 0.5; Wattage: 1/16W; DIST: FLAT; MAX_TEMP: RTMAX; MFG: Yageo; TC1: 0; Assy: DNI; PCB Footprint: R0201; Length(mm): 1; Width(mm): 0.5; TC2: 0; Value: 33 ohm; Manufacturer: Yageo
U3 = LIFCL-40-BG400: Part Reference: U3; Source Part: LIFCL-40-BG400A.Normal; SWAP_INFO: (S1+S2+S3+S4+S5+S6+S7+S8+S9+S10+S11+S12+S13+S14+S15); SPLIT_INST: TRUE; Name: I17266603; Primitive: DEFAULT; Implementation Type: <none>; Location X-Coordinate: 0; Source Library: C:\USERS\SLIU1\DOCUMENTS\PCB_DESIGN\JEDI_EVAL_BOARD\SCHEMATIC\LIFCL40.OLB; Power Pins Visible: False; Value: LIFCL-40-BG400; Assy: -; Location Y-Coordinate: 0; Color: Default; Source Package: LIFCL-40-BG400; Graphic: LIFCL-40-BG400A.Normal; PCB Footprint: LIFCL-40-BG400
U5 = CMP-0440-00179-4: IC BUF NON-INVERT 3.6V 14TSSOP; Max Power Dissipation: 500mW; Number of Bits per Element: 1; Number of Bits: 4; Quiescent Current: 1uA; Min Supply Voltage: 1.65V; Propagation Delay: 4.6ns; High Level Output Current: -24mA; Logic Function: Buffer; Low Level Output Current: 24mA; Polarity: Non-Inverting; Turn-On Delay Time: 5.3ns; Number of Output Lines: 3; Mount: Surface Mount; Lead Free: Lead Free; Number of Outputs: 4; Max Supply Voltage: 3.6V; Packaging: Tape and Reel; Radiation Hardening: No; Number of Channels: 4; REACH SVHC: No SVHC; Length: 5mm; Number of Elements: 4; Contact Plating: Gold; Case/Package: TSSOP; Number of Input Lines: 4; Number of Inputs: 4; Height: 1.15mm; Number of Circuits: 4; Termination: SMD/SMT; Min Operating Temperature: -40°C; Package Quantity: 1; Number of Gates: 4; Max Operating Temperature: 125°C; Width: 4.4mm; Number of Pins: 14
U9 = CMP-0859-00680-4: IC BUFFER NON-INVERT 5.5V US8; Manufacturer: Texas Instruments; Propagation Delay: 4.2ns; Number Of Outputs: 1; Logic Function Desc: Non-Inverting; Max Junction Temp: +150°C; Number Of Circuits: 2; Min Supply Voltage: 1.65V; Standoff Height: 0mm; Mouser Description: Buffers & Line Drivers Tri-State Dual Bus; Package: DCU0008A; Digikey Description: IC BUFFER NON-INVERT 5.5V US8; Height: 0.9mm; Device Class L3: Buffers; ComponentLink2URL: http://www.ti.com/lit/ds/symlink/sn74lvc2g125.pdf; Temperature Range Low: -40°C; Automotive: No; Max Supply Voltage: 5.5V; Temperature: -40°C to +125°C; ComponentLink2Description: Datasheet; Device Class L2: Logic ICs; Lead Free: Yes; Ipc Land Pattern Name: SOP50P310X75-8; Octopart: https://octopart.com/sn74lvc2g125dcur-texas+instruments-464564; Category: IC; Number Of Inputs: 1; Ambient Temperature Range Low: -40°C; RoHS: TRUE; Temperature Range High: +125°C; Device Class L1: Integrated Circuits (ICs); Manufacturer Part Number: SN74LVC2G125DCUR; Ambient Temperature Range High: +125°C

## Sheet 07 - USB Interface.SchDoc: USB Interface
size A3; Date:: 0; Page Number: 7; Page Size: B; Page Count: 12; Board Rev: B; Project Name: CrossLink-NX Evaluation Board; RevCode: 1.0; Doc: 305-PD-19-0819; DsnPath: C:\Users\HAltinkilit\Downloads\Crosslink-NX-Design-Files\CrossLink-NX-Eval-Brd-Schematic-RevB-191122.DSN; SchematicName: SCHEMATIC1; PageName: 03 - USB Interface; PageSize: B; TopSchematic: True
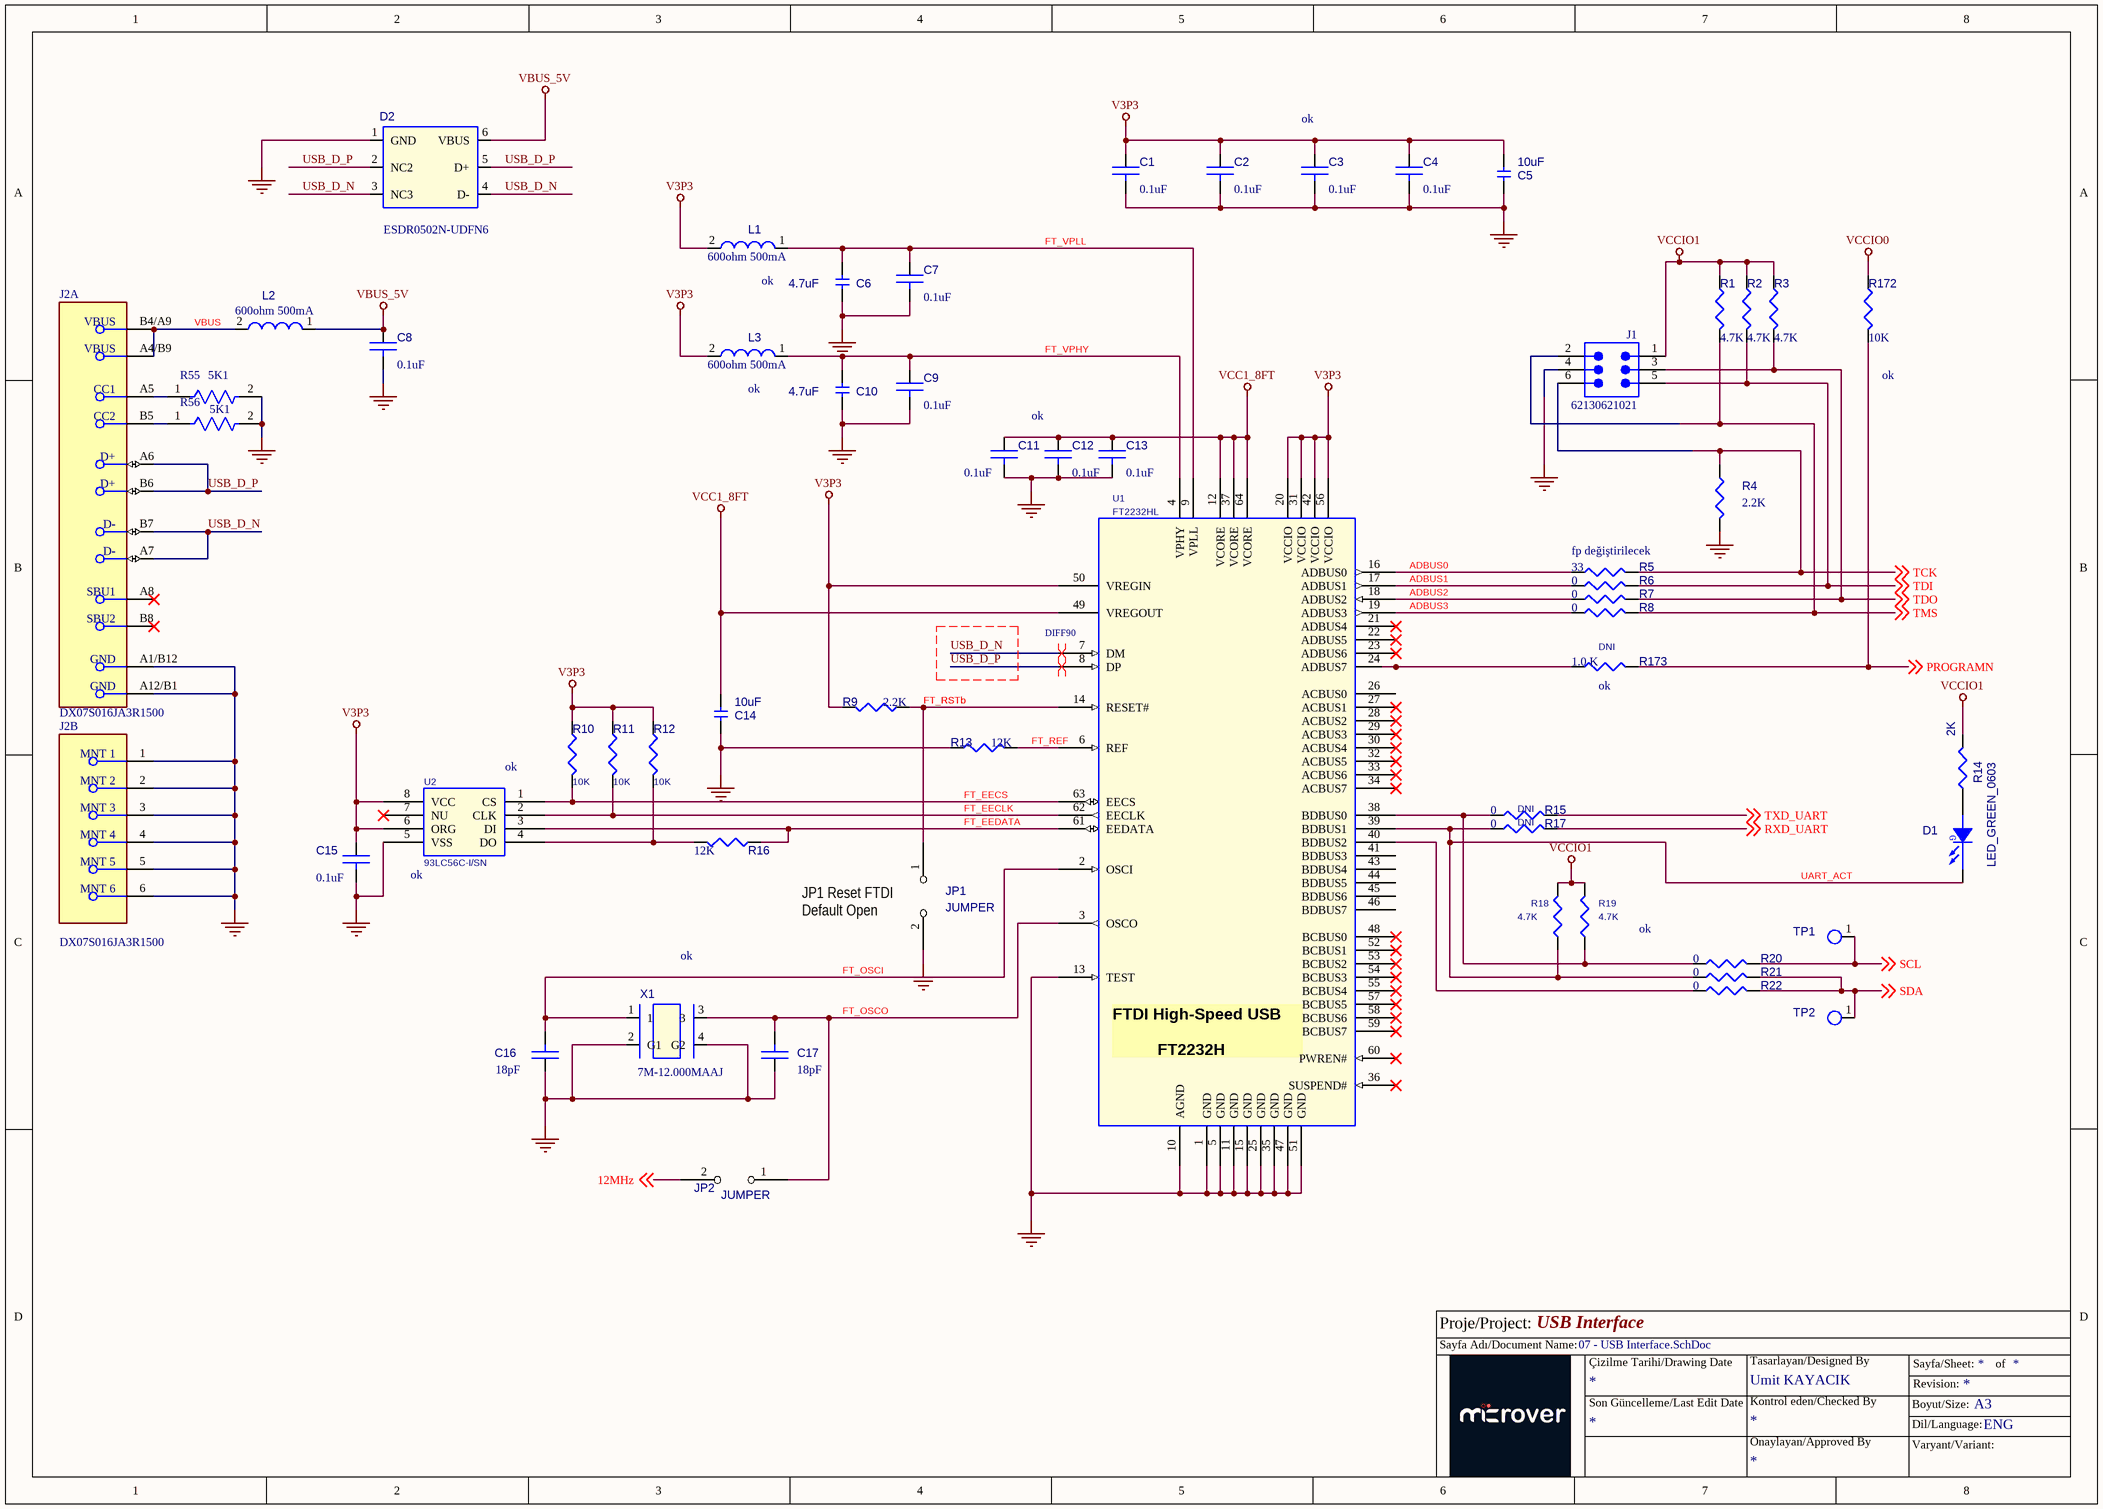
[diagram p6: 07 - USB Interface.SchDoc]

### Parts
C1  0.1uF  [C0201]
C2  0.1uF  [C0201]
C3  0.1uF  [C0201]
C4  0.1uF  [C0201]
C5  10uF  [C0603]
C6  4.7uF  [C0603]
C7  0.1uF  [C0201]
C8  0.1uF  [C0402]
C9  0.1uF  [C0201]
C10  4.7uF  [C0603]
C11  0.1uF  [C0201]
C12  0.1uF  [C0201]
C13  0.1uF  [c0201]
C14  10uF  [C0603]
C15  0.1uF  [C0201]
C16  18pF  [C0402]
C17  18pF  [C0402]
D1  LED_GREEN_0603  [APT1608]
D2  ESDR0502N-UDFN6  [UDFN6_040]
J1  62130621021  [62130621021]
J2  DX07S016JA3R1500  [FP-DX07S016JA3R1500-MFG]  (parts A,B of 2)
JP1  JUMPER  [R0603]
JP2  JUMPER  [0603]
L1  600ohm 500mA  [FB0603]
L2  600ohm 500mA  [FB0603]
L3  600ohm 500mA  [FB0603]
R1  4.7K  [R0603]
R2  4.7K  [R0603]
R3  4.7K  [R0603]
R4  2.2K  [R0603]
R5  33  [R0402]
R6  0  [R0603]
R7  0  [R0603]
R8  0  [R0603]
R9  2.2K  [R0603]
R10  10K  [R0603]
R11  10K  [R0603]
R12  10K  [R0603]
R13  12K  [R0603]
R14  2K  [R0402]
R15  0  Assy: DNI  [R0603]
R16  12K  [R0603]
R17  0  Assy: DNI  [R0603]
R18  4.7K  [RLP-101]
R19  4.7K  [RLP-101]
R20  0  [R0603]
R21  0  [R0603]
R22  0  [R0603]
R55  5K1  [FP-CR0402-IPC_A]
R56  5K1  [FP-CR0402-IPC_A]
R172  10K  [R0603]
R173  1.0 K  Assy: DNI  [R0603]
TP1  TP_S_40_63  [TP_1MM]  (value not drawn)
TP2  TP_S_40_63  [TP_1MM]  (value not drawn)
U1  FT2232HL  [tqfp64_0p5_12p2x12p2_h1p6]
U2  93LC56C-I/SN  [so8_50_244]
X1  7M-12.000MAAJ  [xtal_4p_7m]

### Nets
GND: C1.2 C2.2 C3.2 C4.2 C5.1 C6.1 C7.2 C8.2 C9.2 C10.1 C11.2 C12.2 C13.2 C14.1 C15.2 C16.1 C17.1 D2.1(GND) J1.4 J2.1(MNT_1) J2.2(MNT_2) J2.3(MNT_3) J2.4(MNT_4) J2.5(MNT_5) J2.6(MNT_6) J2.A1/B12(GND) J2.A12/B1(GND) JP1.2 R4.2 R13.1 R55.2 R56.2 U1.1(GND) U1.5(GND) U1.10(AGND) U1.11(GND) U1.13(TEST) U1.15(GND) U1.25(GND) U1.35(GND) U1.47(GND) U1.51(GND) U2.5(VSS) X1.2(G1) X1.4(G2)
V3P3: C1.1 C2.1 C3.1 C4.1 C5.2 C15.1 L1.2 L3.2 R9.2 R10.1 R11.1 R12.1 U1.20(VCCIO) U1.31(VCCIO) U1.42(VCCIO) U1.50(VREGIN) U1.56(VCCIO) U2.6(ORG) U2.8(VCC)
VBUS_5V: C8.1 D2.6(VBUS) L2.1
VCC1_8FT: C11.1 C12.1 C13.1 C14.2 U1.12(VCORE) U1.37(VCORE) U1.49(VREGOUT) U1.64(VCORE)
VCCIO0: R172.1
VCCIO1: J1.1 R1.1 R2.1 R3.1 R14.2 R18.2 R19.2
12MHz: JP2.2 ; off-sheet 12MHz
ADBUS0: R5.1 U1.16(ADBUS0)
ADBUS1: R6.1 U1.17(ADBUS1)
ADBUS2: R7.1 U1.18(ADBUS2)
ADBUS3: R8.1 U1.19(ADBUS3)
FT_EECLK: R11.2 U1.62(EECLK) U2.2(CLK)
FT_EECS: R10.2 U1.63(EECS) U2.1(CS)
FT_EEDATA: R16.1 U1.61(EEDATA) U2.3(DI)
FT_OSCI: C16.2 U1.2(OSCI) X1.1
FT_OSCO: C17.2 JP2.1 U1.3(OSCO) X1.3
FT_REF: R13.2 U1.6(REF)
FT_RSTb: JP1.1 R9.1 U1.14(RESET#)
FT_VPHY: C9.1 C10.2 L3.1 U1.4(VPHY)
FT_VPLL: C6.2 C7.1 L1.1 U1.9(VPLL)
PROGRAMN: R172.2 R173.2 ; off-sheet PROGRAMN
RXD_UART: R17.2 ; off-sheet RXD_UART
SCL: R20.2 TP1.1(TP) ; off-sheet SCL
SDA: R21.2 R22.2 TP2.1(TP) ; off-sheet SDA
TCK: J1.6 R4.1 R5.2 ; off-sheet TCK
TDI: J1.5 R2.2 R6.2 ; off-sheet TDI
TDO: J1.3 R3.2 R7.2 ; off-sheet TDO
TMS: J1.2 R1.2 R8.2 ; off-sheet TMS
TXD_UART: R15.2 ; off-sheet TXD_UART
UART_ACT: D1.1(CATHODE) R17.1 R18.1 R21.1 U1.39(BDBUS1)
USB_D_N: D2.3(NC3) D2.4(D-) J2.A7(D-) J2.B7(D-) U1.7(DM)
USB_D_P: D2.2(NC2) D2.5(D+) J2.A6(D+) J2.B6(D+) U1.8(DP)
VBUS: J2.A4/B9(VBUS) J2.B4/A9(VBUS) L2.2
NetD1_2: D1.2(ANODE) R14.1
NetJ2_A5: J2.A5(CC1) R55.1
NetJ2_B5: J2.B5(CC2) R56.1
NetR12_2: R12.2 R16.2 U2.4(DO)
NetR15_1: R15.1 R19.1 R20.1 U1.38(BDBUS0)
NetR22_1: R22.1 U1.40(BDBUS2)
NetR173_1: R173.1 U1.24(ADBUS7)

Not connected (* = marked no-connect by the designer): J2 A8(SBU1)* B8(SBU2)*; U1 21(ADBUS4)* 22(ADBUS5)* 23(ADBUS6)* 26(ACBUS0) 27(ACBUS1)* 28(ACBUS2)* 29(ACBUS3)* 30(ACBUS4)* 32(ACBUS5)* 33(ACBUS6)* 34(ACBUS7)* 36(SUSPEND#)* 41(BDBUS3) 43(BDBUS4) 44(BDBUS5) 45(BDBUS6) 46(BDBUS7) 48(BCBUS0)* 52(BCBUS1)* 53(BCBUS2)* 54(BCBUS3)* 55(BCBUS4)* 57(BCBUS5)* 58(BCBUS6)* 59(BCBUS7)* 60(PWREN#)*; U2 7(NU)*

### Layout directives
differential pair; differential pair class DIFF90: USB_D_N, USB_D_P

### Notes on the sheet
- (near C3) ok
- (near L1) ok
- (near R172) ok
- (near L3) ok
- ok
- (near R5) fp değiştirilecek
- (near R173) ok
- (near U2) ok
- (near JP1) JP1 Reset FTDI
  Default Open
- Proje/Project:
- Sayfa Adı/Document Name:
- Çizilme Tarihi/Drawing Date
- Umit KAYACIK
- Tasarlayan/Designed By
- Sayfa/Sheet:
- Revision:
- of
- Son Güncelleme/Last Edit Date
- Kontrol eden/Checked By
- Onaylayan/Approved By
- Boyut/Size:
- Varyant/Variant:
- Dil/Language:
- A3
- ENG
- (in symbol FT2232HL) FTDI High-Speed USB / FT2232H
- (in symbol LED-SMT1206_GREEN_1) G

### Library data of the parts
C1 = 0u1_0402: CAP CER 0.1UF 25V 10% X5R 0201; Manufacturer: Murata; Manufacturer Part Number: GRM033R61E104KE14J; Part Reference: C1; Class: Discrete; Digikey P/N: 399-3521-2-ND; Assy: -; Value: 0.1uF; PCB Footprint: C0201
C2 = 0u1_0402: CAP CER 0.1UF 25V 10% X5R 0201; Manufacturer: Murata; Manufacturer Part Number: GRM033R61E104KE14J; Part Reference: C2; Class: Discrete; Digikey P/N: 399-3521-2-ND; Assy: -; Value: 0.1uF; PCB Footprint: C0201
C3 = 0u1_0402: CAP CER 0.1UF 25V 10% X5R 0201; Manufacturer: Murata; Manufacturer Part Number: GRM033R61E104KE14J; Part Reference: C3; Class: Discrete; Digikey P/N: 399-3521-2-ND; Assy: -; Value: 0.1uF; PCB Footprint: C0201
C4 = 0u1_0402: CAP CER 0.1UF 25V 10% X5R 0201; Manufacturer: Murata; Manufacturer Part Number: GRM033R61E104KE14J; Part Reference: C4; Class: Discrete; Digikey P/N: 399-3521-2-ND; Assy: -; Value: 0.1uF; PCB Footprint: C0201
C5 = C: Part Reference: C5; DIST: FLAT; PSpiceTemplate: C^@REFDES %1 %2 ?TOLERANCE|C^@REFDES| @VALUE ?IC/IC=@IC/ ?TOLERANCE|\n.model C^@REFDES CAP C=1 DEV=@TOLERANCE%|; VOLTAGE: CMAX; CURRENT: CIMAX; KNEE: CBMAX; SLOPE: CSMAX; MAX_TEMP: CTMAX; Populate: <Populate>; Value: 10uF; Assy: -; PCB Footprint: C0603
C6 = C: Part Reference: C6; DIST: FLAT; PSpiceTemplate: C^@REFDES %1 %2 ?TOLERANCE|C^@REFDES| @VALUE ?IC/IC=@IC/ ?TOLERANCE|\n.model C^@REFDES CAP C=1 DEV=@TOLERANCE%|; VOLTAGE: CMAX; CURRENT: CIMAX; KNEE: CBMAX; SLOPE: CSMAX; MAX_TEMP: CTMAX; Populate: <Populate>; Value: 4.7uF; Assy: -; PCB Footprint: C0603
C7 = 0u1_0402: CAP CER 0.1UF 25V 10% X5R 0201; Manufacturer: Murata; Manufacturer Part Number: GRM033R61E104KE14J; Part Reference: C7; Class: Discrete; Digikey P/N: 399-3521-2-ND; Assy: -; Value: 0.1uF; PCB Footprint: C0201
C8 = 0u1_0402: CAP CER 0.1UF 25V 10% X5R 0201; Manufacturer: Murata; Manufacturer Part Number: GRM033R61E104KE14J; Part Reference: C8; Class: Discrete; PCB Footprint: C0201; Digikey P/N: 399-3521-2-ND; Assy: -; Value: 0.1uF
C9 = 0u1_0402: CAP CER 0.1UF 25V 10% X5R 0201; Manufacturer: Murata; Manufacturer Part Number: GRM033R61E104KE14J; Part Reference: C9; Class: Discrete; Digikey P/N: 399-3521-2-ND; Assy: -; Value: 0.1uF; PCB Footprint: C0201
C10 = C: Part Reference: C10; DIST: FLAT; PSpiceTemplate: C^@REFDES %1 %2 ?TOLERANCE|C^@REFDES| @VALUE ?IC/IC=@IC/ ?TOLERANCE|\n.model C^@REFDES CAP C=1 DEV=@TOLERANCE%|; VOLTAGE: CMAX; CURRENT: CIMAX; KNEE: CBMAX; SLOPE: CSMAX; MAX_TEMP: CTMAX; Populate: <Populate>; Value: 4.7uF; Assy: -; PCB Footprint: C0603
C11 = 0u1_0402: CAP CER 0.1UF 25V 10% X5R 0201; Manufacturer: Murata; Manufacturer Part Number: GRM033R61E104KE14J; Part Reference: C11; Class: Discrete; Digikey P/N: 399-3521-2-ND; Assy: -; Value: 0.1uF; PCB Footprint: C0201
C12 = 0u1_0402: CAP CER 0.1UF 25V 10% X5R 0201; Manufacturer: Murata; Manufacturer Part Number: GRM033R61E104KE14J; Part Reference: C12; Class: Discrete; Digikey P/N: 399-3521-2-ND; Assy: -; Value: 0.1uF; PCB Footprint: C0201
C13 = 0u1_0402: CAP CER 0.1UF 25V 10% X5R 0201; Manufacturer: Murata; Manufacturer Part Number: GRM033R61E104KE14J; Part Reference: C13; Class: Discrete; Digikey P/N: 399-3521-2-ND; Assy: -; Value: 0.1uF; PCB Footprint: C0201
C14 = C: Part Reference: C14; DIST: FLAT; PSpiceTemplate: C^@REFDES %1 %2 ?TOLERANCE|C^@REFDES| @VALUE ?IC/IC=@IC/ ?TOLERANCE|\n.model C^@REFDES CAP C=1 DEV=@TOLERANCE%|; VOLTAGE: CMAX; CURRENT: CIMAX; KNEE: CBMAX; SLOPE: CSMAX; MAX_TEMP: CTMAX; Populate: <Populate>; Value: 10uF; Assy: -; PCB Footprint: C0603
C15 = 0u1_0402: CAP CER 0.1UF 25V 10% X5R 0201; Manufacturer: Murata; Manufacturer Part Number: GRM033R61E104KE14J; Part Reference: C15; Class: Discrete; Digikey P/N: 399-3521-2-ND; Assy: -; Value: 0.1uF; PCB Footprint: C0201
C16 = 0u1_0402: CAP CER 18PF 25V 10% NP0 0402; Manufacturer: Kemet; Manufacturer Part Number: C0402C180K3GACTU; Part Reference: C16; Class: Discrete; Digikey P/N: C0402C180K3GACTU-ND; Assy: -; Value: 18pF; PCB Footprint: C0402
C17 = 0u1_0402: CAP CER 18PF 25V 10% NP0 0402; Manufacturer: Kemet; Manufacturer Part Number: C0402C180K3GACTU; Part Reference: C17; Class: Discrete; Digikey P/N: C0402C180K3GACTU-ND; Assy: -; Value: 18pF; PCB Footprint: C0402
D1 = LED-SMT1206_GREEN_1: Part Reference: D1; Value: LED_GREEN_0603; PCB Footprint: APT1608; Assy: -
D2 = ESDR0502: ESD Protection - SLP2510P8 package 8-PIN; Part Reference: D2; ALS LIB: L0000; CLASS: IC; Vendor: Digikey; MFG: Semtech; MFG P/N: RClamp0524P; Vendor P/N: RCLAMP0524PTR-ND; Value: ESDR0502N-UDFN6; PCB Footprint: UDFN6_040; Assy: -
J1 = CMP-1502-00936-4: Conn, Pin Hdr, 6POS, 2ROW, 1.27MM Rohs Compliant: Yes
J2 = CMP-19038-000002-1: CONN RCP USB2.0 TYP C 24P SMD RA
JP1 = JUMPER_0: Part Reference: JP1; PCB Footprint: Header_1x2; Value: JUMPER; Assy: -
JP2 = JUMPER_0: Part Reference: JP2; PCB Footprint: Header_1x2; Value: JUMPER; Assy: -
L1 = FB0603: FERRITE CHIP 600 OHM 500MA 0603; Manufacturer: Murata; Manufacturer Part Number: BLM18AG601SN1D; Part Reference: L1; Class: Discrete; Digikey P/N: 490-1014-1-ND; Value: 600ohm 500mA; PCB Footprint: fb0603; Assy: -
L2 = FB0603: FERRITE CHIP 600 OHM 500MA 0603; Manufacturer: Murata; Manufacturer Part Number: BLM18AG601SN1D; Part Reference: L2; Class: Discrete; Digikey P/N: 490-1014-1-ND; Value: 600ohm 500mA; PCB Footprint: fb0603; Assy: -
L3 = FB0603: FERRITE CHIP 600 OHM 500MA 0603; Manufacturer: Murata; Manufacturer Part Number: BLM18AG601SN1D; Part Reference: L3; Class: Discrete; Digikey P/N: 490-1014-1-ND; Value: 600ohm 500mA; PCB Footprint: fb0603; Assy: -
R1 = 5k1_0402: RES 4.70K OHM 1/10W 1% 0603 SMD; Manufacturer Part Number: CRCW06034K70FKEA; Manufacturer: Vishay; Part Reference: R1; Class: Discrete; Digikey P/N: 541-4.70KHTR-ND; Assy: -; Value: 4.7K; PCB Footprint: R0603
R2 = 5k1_0402: RES 4.70K OHM 1/10W 1% 0603 SMD; Manufacturer Part Number: CRCW06034K70FKEA; Manufacturer: Vishay; Part Reference: R2; Class: Discrete; Digikey P/N: 541-4.70KHTR-ND; Assy: -; Value: 4.7K; PCB Footprint: R0603
R3 = 5k1_0402: RES 4.70K OHM 1/10W 1% 0603 SMD; Manufacturer Part Number: CRCW06034K70FKEA; Manufacturer: Vishay; Part Reference: R3; Class: Discrete; Digikey P/N: 541-4.70KHTR-ND; Assy: -; Value: 4.7K; PCB Footprint: R0603
R4 = 5k1_0402: Manufacturer Part Number: CRCW06032K20FKEA; Manufacturer: Vishay; Part Reference: R4; Class: Discrete; Digikey P/N: 541-2.20KHTR-ND; Assy: -; Value: 2.2K; PCB Footprint: R0603
R5 = 0R_0603: RES SMD 33 OHM 1% 1/10W 0402; Manufacturer: Panasonic; Manufacturer Part Number: ERJ-2RKF33R0X; Part Reference: R5; Class: Discrete; Digikey P/N: 311-0.0GRTR-ND; Assy: -; Value: 33; PCB Footprint: R0402
R6 = 0R_0603: RES 0.0 OHM 1/10W JUMP 0603 SMD; Manufacturer: Yageo; Manufacturer Part Number: RC0603JR-070RL; Part Reference: R6; Class: Discrete; Digikey P/N: 311-0.0GRTR-ND; Assy: -; Value: 0; PCB Footprint: R0603
R7 = 0R_0603: RES 0.0 OHM 1/10W JUMP 0603 SMD; Manufacturer: Yageo; Manufacturer Part Number: RC0603JR-070RL; Part Reference: R7; Class: Discrete; Digikey P/N: 311-0.0GRTR-ND; Assy: -; Value: 0; PCB Footprint: R0603
R8 = 0R_0603: RES 0.0 OHM 1/10W JUMP 0603 SMD; Manufacturer: Yageo; Manufacturer Part Number: RC0603JR-070RL; Part Reference: R8; Class: Discrete; Digikey P/N: 311-0.0GRTR-ND; Assy: -; Value: 0; PCB Footprint: R0603
R9 = 5k1_0402: Manufacturer Part Number: CRCW06032K20FKEA; Manufacturer: Vishay; Part Reference: R9; Class: Discrete; Digikey P/N: 541-2.20KHTR-ND; Assy: -; Value: 2.2K; PCB Footprint: R0603
R10 = RES_10K_1W16_0402_5P: RES 10K OHM 1/10W 5% 0603; Part Reference: R10; Manufacturer Part Number: RMCF0603JT10K0; Unit Price (USD): 0.02; Total Area(sq-mm): 0.5; DIST: FLAT; MAX_TEMP: RTMAX; MFG P/N: RMCF0402JT10K0; MFG: Stackpole Electronics Inc; TC1: 0; Length(mm): 1; Width(mm): 0.5; Wattage: 1/10W; TC2: 0; Value: 10K; PCB Footprint: R0603; Manufacturer: Stackpole Electronics Inc; Digikey P/N: RMCF0603JT10K0TR-ND; Assy: -
R11 = RES_10K_1W16_0402_5P: RES 10K OHM 1/10W 5% 0603; Part Reference: R11; Manufacturer Part Number: RMCF0603JT10K0; Unit Price (USD): 0.02; Total Area(sq-mm): 0.5; DIST: FLAT; MAX_TEMP: RTMAX; MFG P/N: RMCF0402JT10K0; MFG: Stackpole Electronics Inc; TC1: 0; Length(mm): 1; Width(mm): 0.5; Wattage: 1/10W; TC2: 0; Value: 10K; PCB Footprint: R0603; Digikey P/N: RMCF0603JT10K0TR-ND; Manufacturer: Stackpole Electronics Inc; Assy: -
R12 = RES_10K_1W16_0402_5P: RES 10K OHM 1/10W 5% 0603; Part Reference: R12; Manufacturer Part Number: RMCF0603JT10K0; Unit Price (USD): 0.02; Total Area(sq-mm): 0.5; DIST: FLAT; MAX_TEMP: RTMAX; MFG P/N: RMCF0402JT10K0; MFG: Stackpole Electronics Inc; TC1: 0; Length(mm): 1; Width(mm): 0.5; Wattage: 1/10W; TC2: 0; Value: 10K; PCB Footprint: R0603; Digikey P/N: RMCF0603JT10K0TR-ND; Manufacturer: Stackpole Electronics Inc; Assy: -
R13 = 10k_0402: RES 12K OHM 1/10W 1% 0603 SMD; Manufacturer: Yageo; Manufacturer Part Number: RC0603FR-0712KL; Part Reference: R13; Class: Discrete; Assy: -; Digikey P/N: 311-12.0KHRTR-ND; Value: 12K; PCB Footprint: R0603; Tolerance: 1%
R14 = RES_0: Part Reference: R14; PCB Footprint: RLP-101; Value: 2K; Assy: -
R15 = 0R_0603: Res 1/10W 0.0 Ohm 5% 0603; Manufacturer: Yageo; Manufacturer Part Number: RC0603JR-070RL; Part Reference: R15; Class: Discrete; Digikey P/N: 311-0.0GRTR-ND; Value: 0; PCB Footprint: R0603
R16 = 10k_0402: RES 12K OHM 1/10W 1% 0603 SMD; Manufacturer: Yageo; Manufacturer Part Number: RC0603FR-0712KL; Part Reference: R16; Class: Discrete; Assy: -; Digikey P/N: 311-12.0KHRTR-ND; Value: 12K; PCB Footprint: R0603; Tolerance: 1%
R17 = 0R_0603: Res 1/10W 0.0 Ohm 5% 0603; Manufacturer: Yageo; Manufacturer Part Number: RC0603JR-070RL; Part Reference: R17; Class: Discrete; Digikey P/N: 311-0.0GRTR-ND; Value: 0; PCB Footprint: R0603
R18 = RESISTOR: Part Reference: R18; Populate: <Populate>; Value: 4.7K; ASSY: -; PCB Footprint: RLP-101
R19 = RESISTOR: Part Reference: R19; Populate: <Populate>; Value: 4.7K; ASSY: -; PCB Footprint: RLP-101
R20 = 0R_0603: RES 0.0 OHM 1/10W JUMP 0603 SMD; Manufacturer: Yageo; Manufacturer Part Number: RC0603JR-070RL; Part Reference: R20; Class: Discrete; Digikey P/N: 311-0.0GRTR-ND; Assy: -; Value: 0; PCB Footprint: R0603
R21 = 0R_0603: RES 0.0 OHM 1/10W JUMP 0603 SMD; Manufacturer: Yageo; Manufacturer Part Number: RC0603JR-070RL; Part Reference: R21; Class: Discrete; Digikey P/N: 311-0.0GRTR-ND; Assy: -; Value: 0; PCB Footprint: R0603
R22 = 0R_0603: RES 0.0 OHM 1/10W JUMP 0603 SMD; Manufacturer: Yageo; Manufacturer Part Number: RC0603JR-070RL; Part Reference: R22; Class: Discrete; Digikey P/N: 311-0.0GRTR-ND; Assy: -; Value: 0; PCB Footprint: R0603
R55 R56 = CMP-2002-05251-2: Thick Film Chip Resistors 0402 5.1kΩ 0.0625W 1% 100ppm/°C; Resistance: 5.1kR; Max Power Dissipation: 63mW; Voltage Rating: 50V; Power Rating: 62.5mW; Case Code (Imperial): 0402; Composition: Thick Film; Packaging: Tape and Reel; Min Operating Temperature: -55°C; Depth: 0.5mm; Tolerance: 1%; Temperature Coefficient: 100ppm/°C; Contact Plating: Tin; Thickness: 356um; Package Quantity: 10000; Military Standard: Not; Case/Package: 0402; Mount: Surface Mount; Max Operating Temperature: 125°C; Length: 1mm; Height: 0.016inch; Width: 0.02inch; Number of Terminations: 2; Radiation Hardening: No; Case Code (Metric): 1005; Termination: SMD/SMT
R172 = 5k1_0402: RES SMD 10K OHM 1% 1/10W 0603; Manufacturer Part Number: RC0603FR-0710KL; Manufacturer: Yageo; Part Reference: R172; Class: Discrete; Digikey P/N: 541-4.70KHTR-ND; Assy: -; Value: 10K; PCB Footprint: R0603
R173 = 0R_0603: RES SMD 1K OHM 1% 1/10W 0603; Manufacturer: Yageo; Manufacturer Part Number: RC0603FR-071KL; Part Reference: R173; Class: Discrete; Digikey P/N: 311-0.0GRTR-ND; Value: 1.0 K; PCB Footprint: R0603
TP1 = TP_S_40_63: Square test point, 40mil inner diameter, 63mil outer diameter; Part Reference: TP1; Assy: DNI; Class: IO; PCB Footprint: TP; Value: TP_S_40_63
TP2 = TP_S_40_63: Square test point, 40mil inner diameter, 63mil outer diameter; Part Reference: TP2; Assy: DNI; Class: IO; PCB Footprint: TP; Value: TP_S_40_63
U1 = FT2232HL: IC USB HS DUAL UART/FIFO 64-LQFP; Manufacturer: FTDI; Part Reference: U1; Assy: Customer Supplied; Class: IC; Manufacturer Part Number: FT2232HL; Digikey P/N: 768-1024-1-ND; Value: FT2232HL; PCB Footprint: tqfp64_0p5_12p2x12p2_h1p6
U2 = 93LC56_SO8_0: IC EEPROM 2KBIT 3MHZ 8SOIC; Manufacturer: Microchip; Part Reference: U2; Digikey P/N: 93LC56C-I/SN-ND; Manufacturer Part Number: 93LC56C-I/SN; Class: IC; Value: 93LC56C-I/SN; PCB Footprint: so8_50_244; Assy: -
X1 = crystal-3p2x2p5: CRYSTAL 12MHZ 18PF SMD; Manufacturer Part Number: 7M-12.000MAAJ-T; Manufacturer: TXC; Part Reference: X1; Class: IC; Digikey P/N: 887-1121-2-ND; Value: 7M-12.000MAAJ; PCB Footprint: xtal_4p_7m; Assy: -